# EAGLE design main_board (EAGLE 7.7.0)
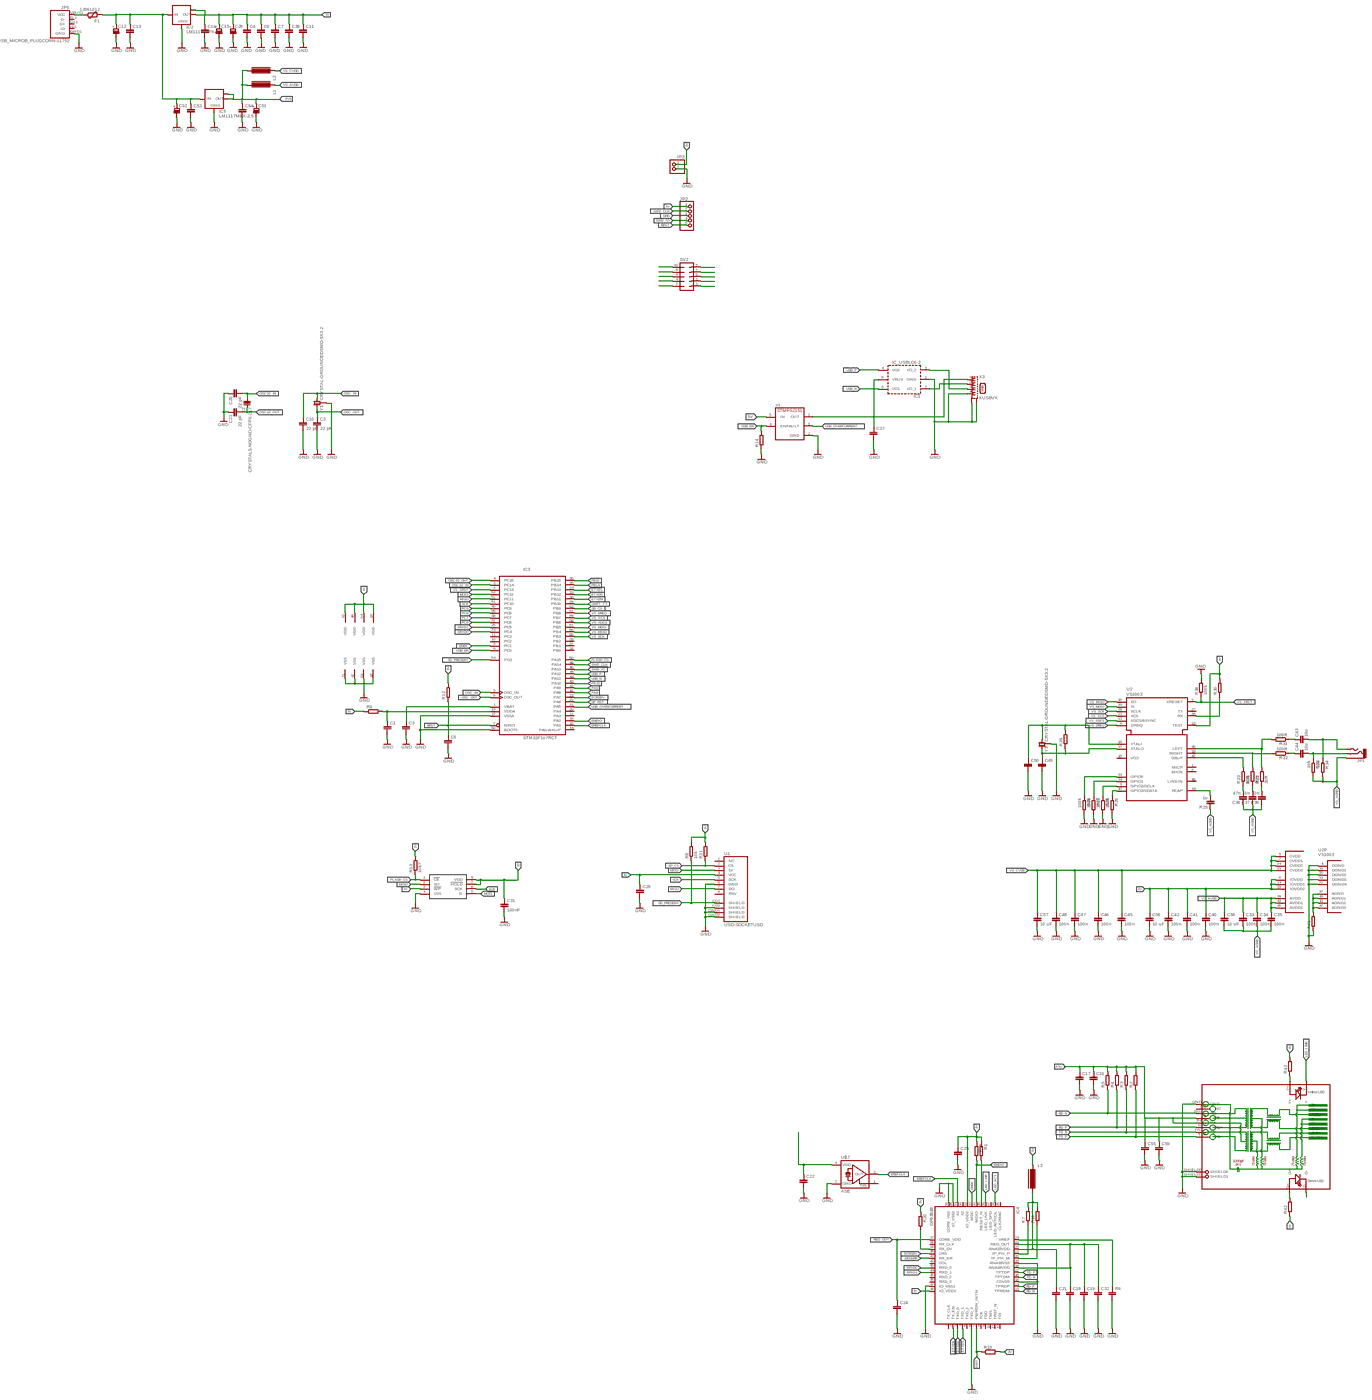
[diagram p0: schematic, sheet 1, overview]
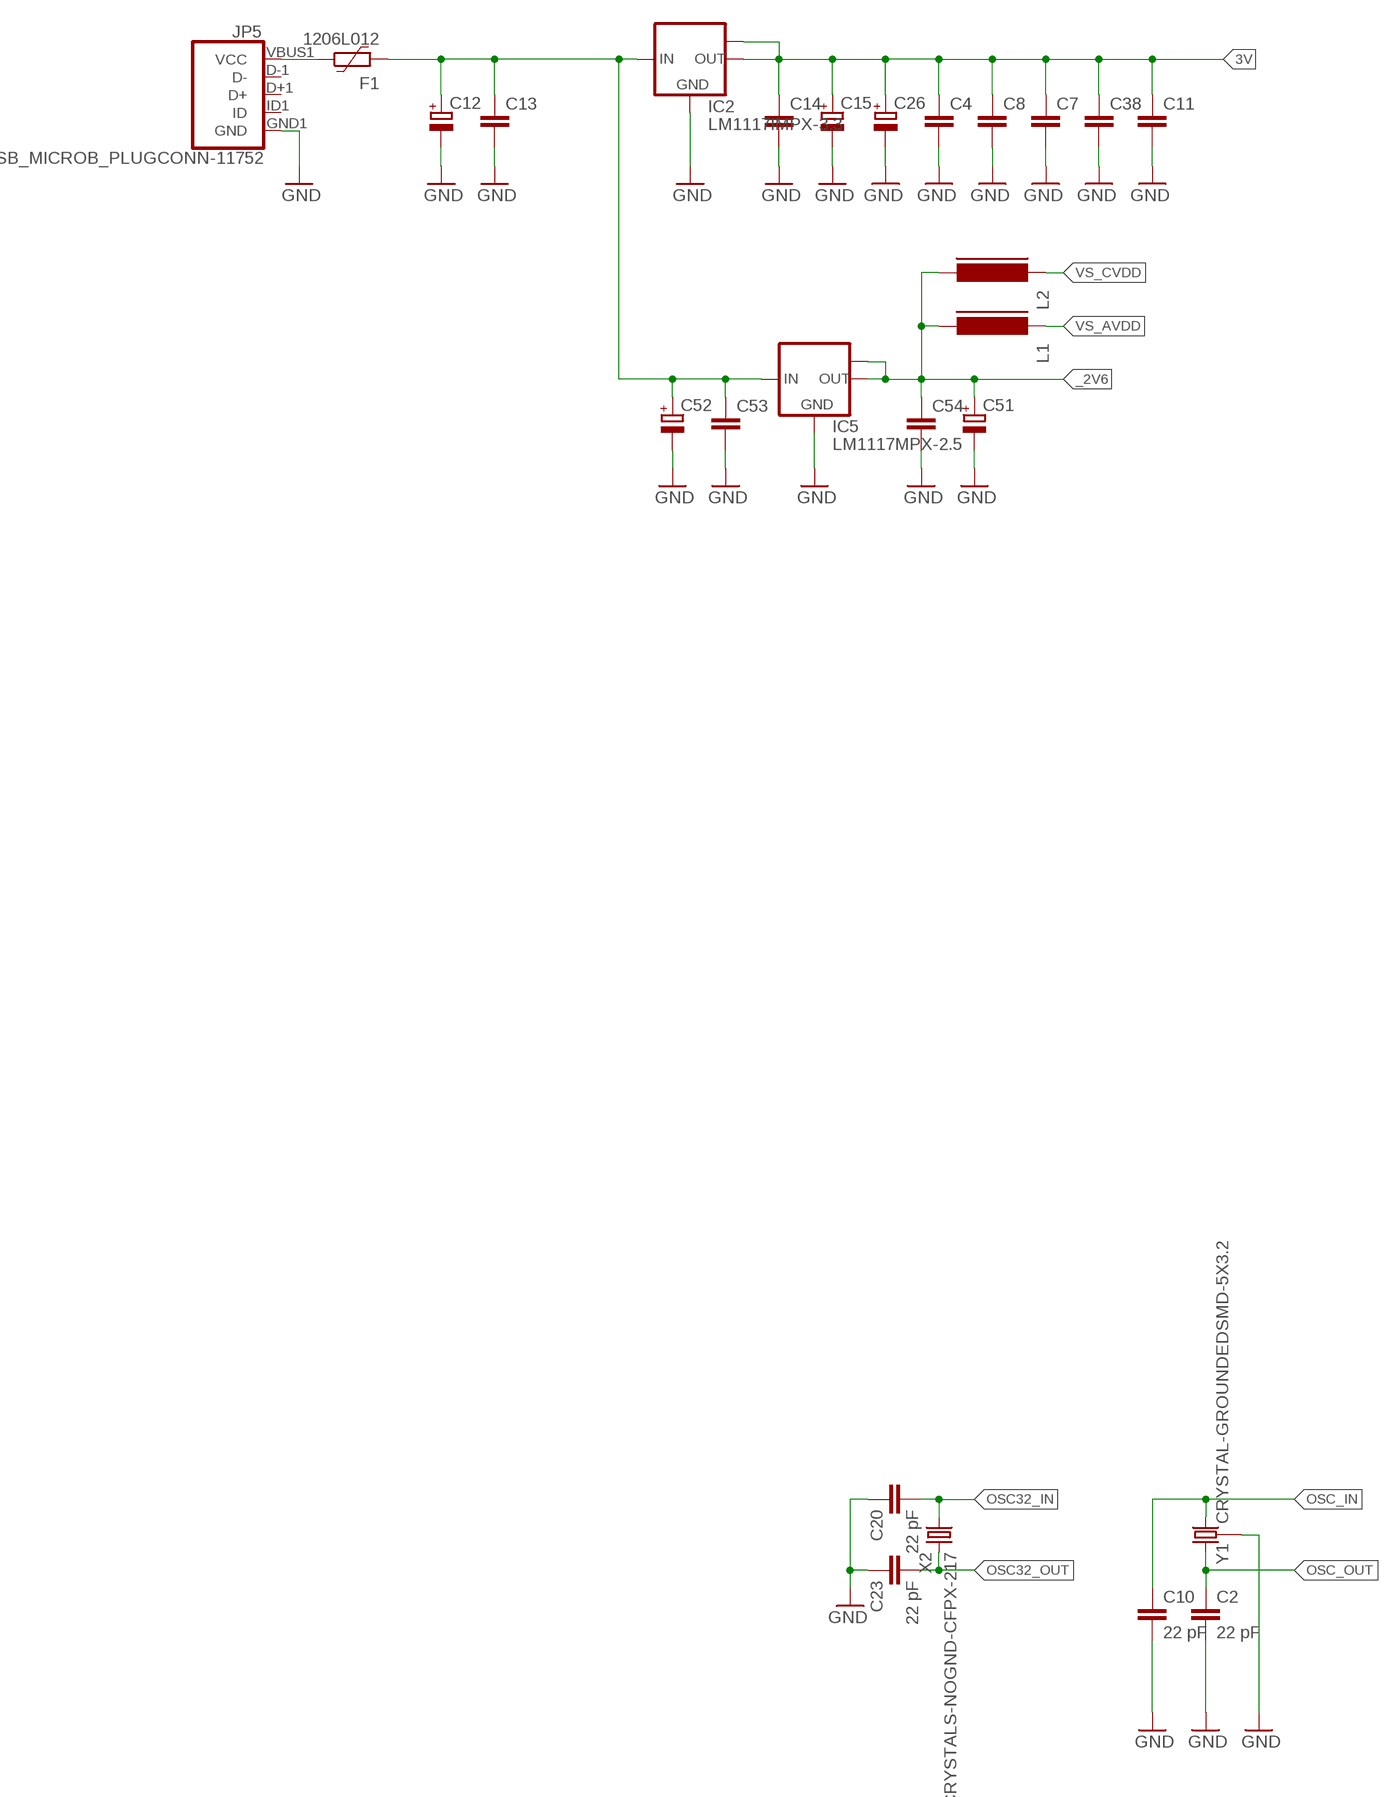
[diagram p1: schematic, sheet 1, part 1 of 4]
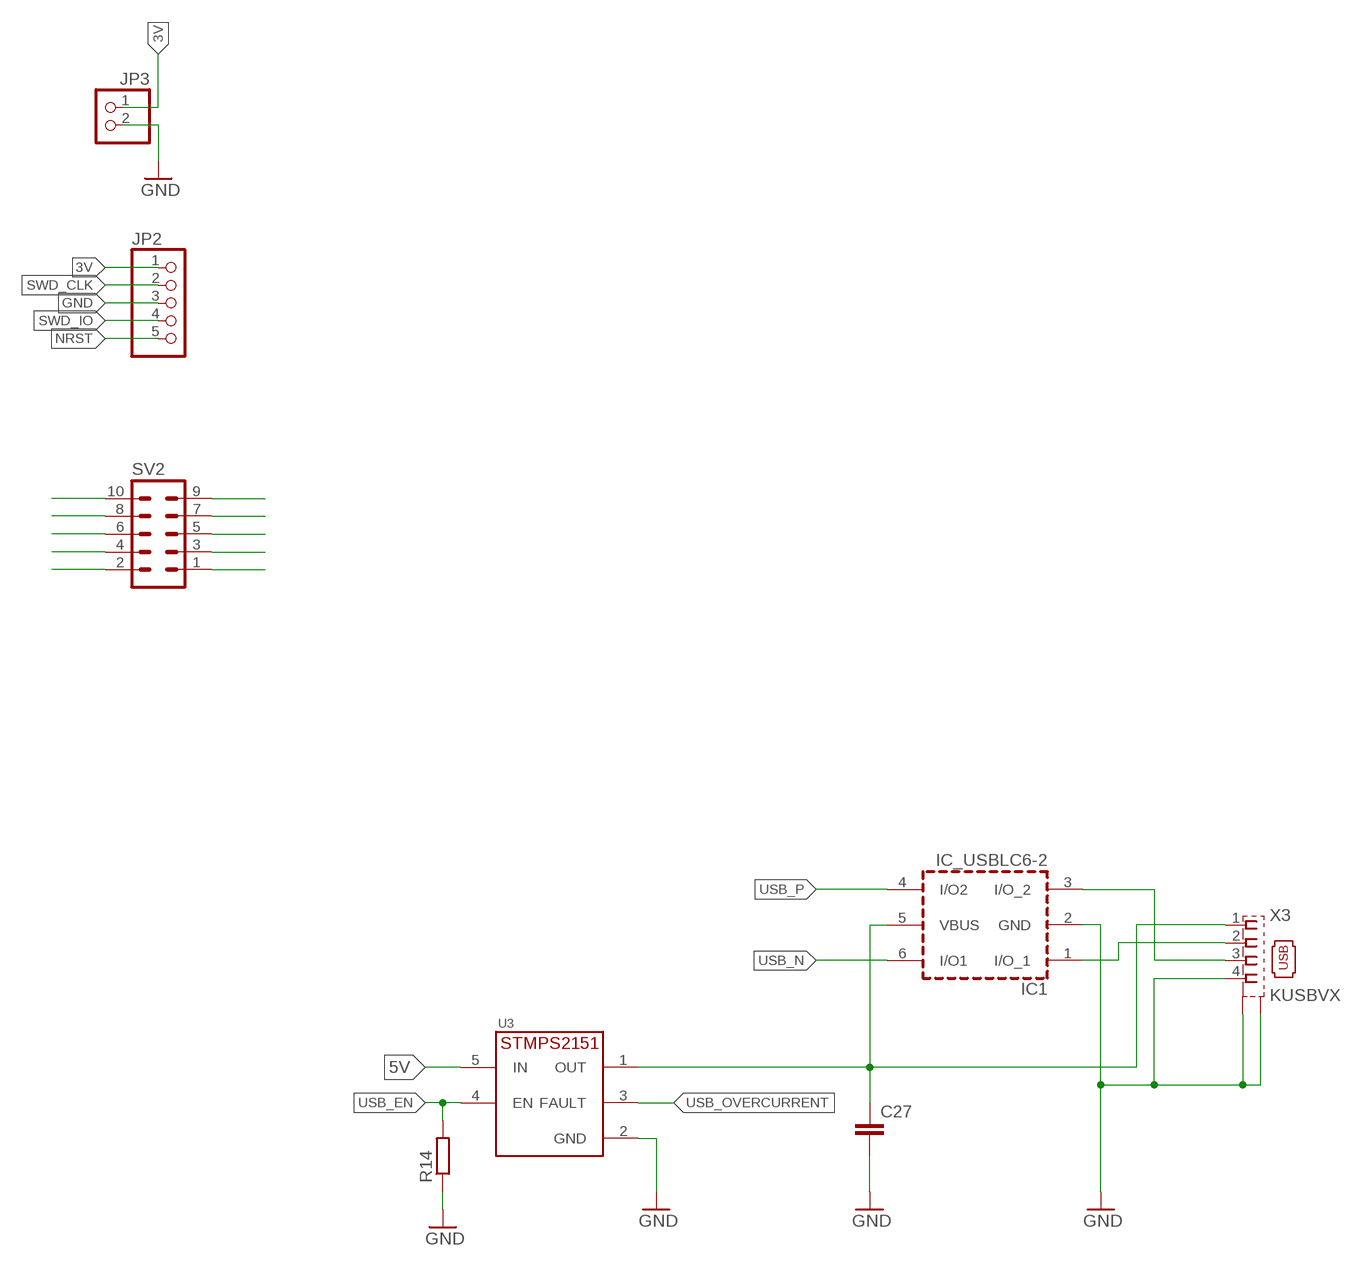
[diagram p2: schematic, sheet 1, part 2 of 4]
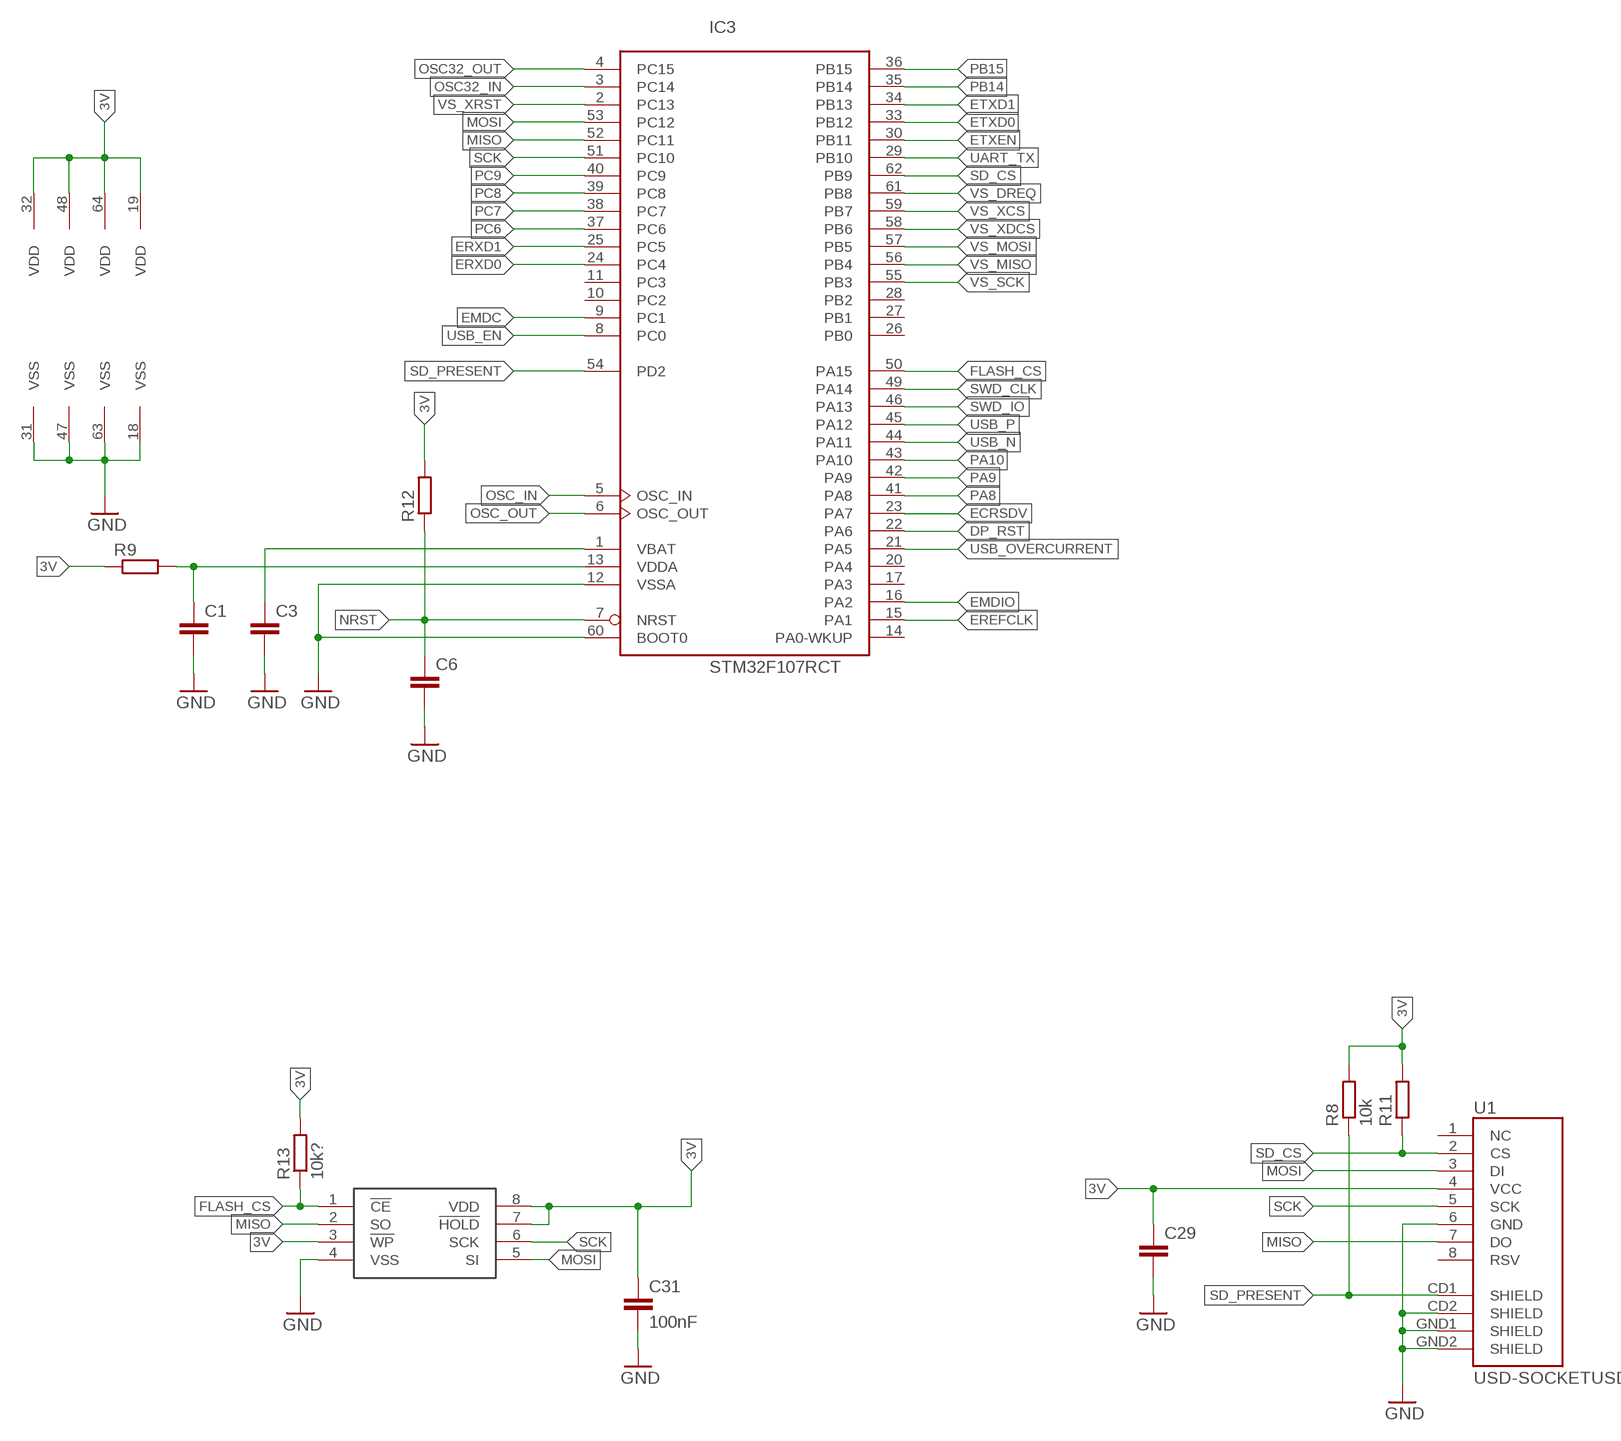
[diagram p3: schematic, sheet 1, part 3 of 4]
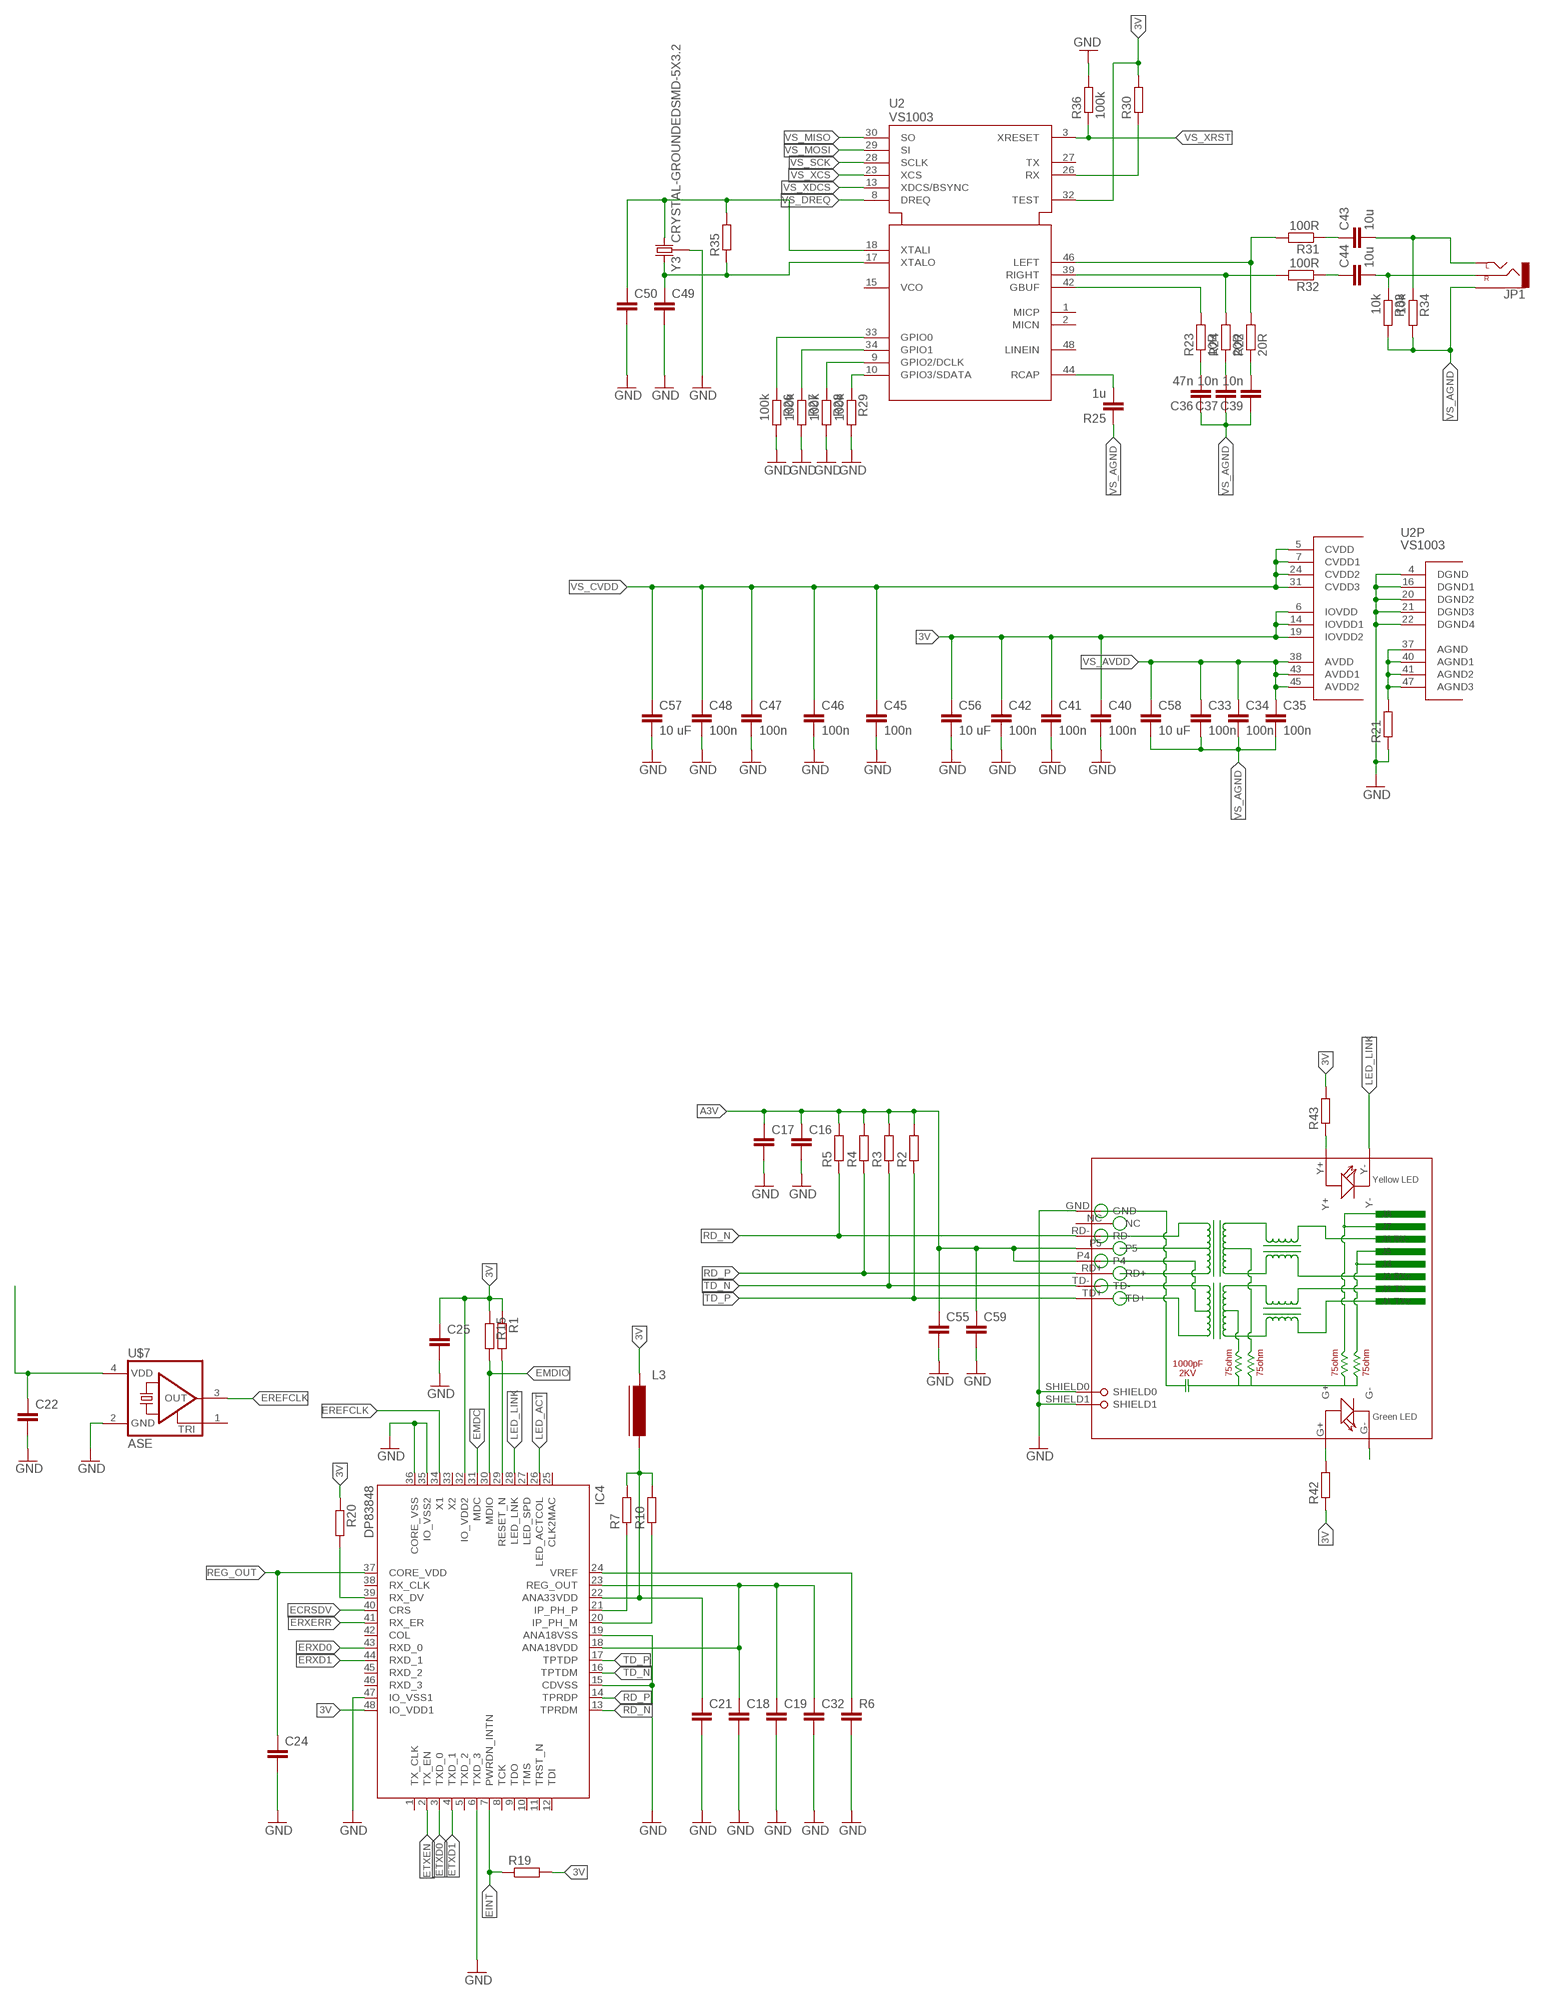
[diagram p4: schematic, sheet 1, part 4 of 4]

## Parts
C1  C-EUC0402  [C0402]
C2  22 pF  C-EUC0603  [C0603]
C3  C-EUC0402  [C0402]
C4  C-EUC0402  [C0402]
C6  C-EUC0603  [C0603]
C7  C-EUC0402  [C0402]
C8  C-EUC0402  [C0402]
C10  22 pF  C-EUC0603  [C0603]
C11  C-EUC0402  [C0402]
C12  CPOL-EUSMCB  [SMC_B]
C13  C-EUC0603  [C0603]
C14  C-EUC0603  [C0603]
C15  CPOL-EUSMCB  [SMC_B]
C16  C-EUC0603  [C0603]
C17  C-EUC0603  [C0603]
C18  C-EUC0402  [C0402]
C19  C-EUC0402  [C0402]
C20  22 pF  C-EUC0603  [C0603]
C21  C-EUC0402  [C0402]
C22  C-EUC0402  [C0402]
C23  22 pF  C-EUC0603  [C0603]
C24  C-EUC0603  [C0603]
C25  C-EUC0603  [C0603]
C26  CPOL-EUSMCA  [SMC_A]
C27  C-EUC0603  [C0603]
C29  C-EUC0603  [C0603]
C31  100nF  C-EUC0603  [C0603]
C32  C-EUC0603  [C0603]
C33  100n  C-EUC0603  [C0603]
C34  100n  C-EUC0603  [C0603]
C35  100n  C-EUC0603  [C0603]
C36  47n  C-EUC0603  [C0603]
C37  10n  C-EUC0603  [C0603]
C38  C-EUC0402  [C0402]
C39  10n  C-EUC0603  [C0603]
C40  100n  C-EUC0402  [C0402]
C41  100n  C-EUC0402  [C0402]
C42  100n  C-EUC0402  [C0402]
C43  10u  C-EUC0603  [C0603]
C44  10u  C-EUC0603  [C0603]
C45  100n  C-EUC0402  [C0402]
C46  100n  C-EUC0603  [C0603]
C47  100n  C-EUC0603  [C0603]
C48  100n  C-EUC0603  [C0603]
C49  C-EUC0603  [C0603]
C50  C-EUC0603  [C0603]
C51  CPOL-EUSMCB  [SMC_B]
C52  CPOL-EUSMCB  [SMC_B]
C53  C-EUC1206  [C1206]
C54  C-EUC1206  [C1206]
C55  C-EUC0603  [C0603]
C56  10 uF  C-EUC0603  [C0603]
C57  10 uF  C-EUC0603  [C0603]
C58  10 uF  C-EUC0603  [C0603]
C59  C-EUC0603  [C0603]
F1  1206L012  [1206L]
IC1  IC_USBLC6-2  [SOT-23-6L]
IC2  LM1117IMPX-3.3  [SOT223]
IC3  STM32F107RCT  [LQFP64]
IC4  DP83848  [LQFP48]
IC5  LM1117MPX-2.5  [SOT223]
JP1  AUDIO-JACKAUDIO_JACK2  [AUDIO-JACK2]
JP2  PINHD-1X5  [1X05]
JP3  PINHD-1X2/90  [1X02/90]
JP5  USB_MICROB_PLUGCONN-11752  [USB-B-MICRO-SMD_V03]
L1  FERRITE-0805  [FB805]
L2  FERRITE-0805  [FB805]
L3  FERRITE-0805  [FB805]
R1  R-EU_R0402  [R0402]
R2  R-EU_R0603  [R0603]
R3  R-EU_R0603  [R0603]
R4  R-EU_R0603  [R0603]
R5  R-EU_R0603  [R0603]
R6  C-EUC0603  [C0603]
R7  R-EU_R0402  [R0402]
R8  10k  R-EU_R0603  [R0603]
R9  R-EU_M0805  [M0805]
R10  R-EU_R0402  [R0402]
R11  R-EU_R0603  [R0603]
R12  R-EU_R0603  [R0603]
R13  10k?  R-EU_R0603  [R0603]
R14  R-EU_R0603  [R0603]
R15  R-EU_R0603  [R0603]
R19  R-EU_R0402  [R0402]
R20  R-EU_R0603  [R0603]
R21  R-EU_R0603  [R0603]
R22  20R  R-EU_R0603  [R0603]
R23  10R  R-EU_R0603  [R0603]
R24  20R  R-EU_R0603  [R0603]
R25  1u  C-EUC0603  [C0603]
R26  100k  R-EU_R0402  [R0402]
R27  100k  R-EU_R0402  [R0402]
R28  100k  R-EU_R0402  [R0402]
R29  100k  R-EU_R0402  [R0402]
R30  R-EU_0204/7  [0204/7]
R31  100R  R-EU_R0603  [R0603]
R32  100R  R-EU_R0603  [R0603]
R33  10k  R-EU_R0603  [R0603]
R34  10k  R-EU_R0603  [R0603]
R35  R-EU_R0603  [R0603]
R36  100k  R-EU_R0603  [R0603]
R42  R-EU_R0603  [R0603]
R43  R-EU_R0603  [R0603]
RJ1  HR911105A  [HR911105A]
SV2  ML10L  [ML10L]
U1  USD-SOCKETUSD  [USD-SOCKET-PP]
U2  VS1003  [LQFP48]
U3  STMPS2151STR  [SOT-23-5L]
U$2  SST25VF016BSO8M  [SO-08M]
U$7  ASE  [ASE]
X2  CRYSTALS-NOGND-CFPX-217  [3.2X1.5-2-PAD]
X3  KUSBVX  [KUSBVX]
Y1  CRYSTAL-GROUNDEDSMD-5X3.2  [CRYSTAL-SMD-5X3.2-4PAD]
Y3  CRYSTAL-GROUNDEDSMD-5X3.2  [CRYSTAL-SMD-5X3.2-4PAD]

## Nets
3V: C4.1 C7.1 C8.1 C11.1 C14.1 C15.+ C22.1 C25.1 C26.+ C29.1 C31.1 C38.1 C40.1 C41.1 C42.1 C56.1 IC2.2(OUT) IC2.TAB(OUT1) IC3.19(VDD) IC3.32(VDD) IC3.48(VDD) IC3.64(VDD) IC4.32(IO_VDD2) IC4.48(IO_VDD1) JP2.1 JP3.1 L3.1 R1.1 R8.2 R9.1 R11.2 R12.2 R13.2 R15.1 R19.2 R20.1 R30.2 R42.1 R43.2 U1.4(VCC) U2.6(IOVDD) U2.14(IOVDD1) U2.19(IOVDD2) U2.32(TEST) U$2.3(!WP) U$2.7(!HOLD) U$2.8(VDD) U$7.4(VDD)
5V: C12.+ C13.1 C52.+ C53.1 F1.2 IC2.3(IN) IC5.3(IN) U3.5(IN)
_2V6: C51.+ C54.1 IC5.2(OUT) IC5.TAB(OUT1) L1.2 L2.2
A3V: C16.1 C17.1 C21.1 C55.1 C59.1 IC4.22(ANA33VDD) L3.2 R2.2 R3.2 R4.2 R5.2 R7.2 R10.2 RJ1.P4 RJ1.P5
D2_N: IC1.1(I/O_1) X3.2
D2_P: IC1.3(I/O_2) X3.3
DP_RST: IC3.22(PA6) IC4.29(RESET_N) R1.2
ECRSDV: IC3.23(PA7) IC4.40(CRS)
EINT: IC4.7(PWRDN_INTN) R19.1
EMDC: IC3.9(PC1) IC4.31(MDC)
EMDIO: IC3.16(PA2) IC4.30(MDIO) R15.2
EREFCLK: IC3.15(PA1) IC4.34(X1) U$7.3(OUT)
ERXD0: IC3.24(PC4) IC4.43(RXD_0)
ERXD1: IC3.25(PC5) IC4.44(RXD_1)
ERXERR: IC4.41(RX_ER)
ETXD0: IC3.33(PB12) IC4.3(TXD_0)
ETXD1: IC3.34(PB13) IC4.4(TXD_1)
ETXEN: IC3.30(PB11) IC4.2(TX_EN)
FLASH_CS: IC3.50(PA15) R13.1 U$2.1(!CE)
GND: C1.2 C2.2 C3.2 C4.2 C6.2 C7.2 C8.2 C10.2 C11.2 C12.- C13.2 C14.2 C15.- C16.2 C17.2 C18.2 C19.2 C20.1 C21.2 C22.2 C23.1 C24.2 C25.2 C26.- C27.2 C29.2 C31.2 C32.2 C38.2 C40.2 C41.2 C42.2 C45.2 C46.2 C47.2 C48.2 C49.2 C50.2 C51.- C52.- C53.2 C54.2 C55.2 C56.2 C57.2 C59.2 IC1.2(GND) IC2.1(GND) IC3.12(VSSA) IC3.18(VSS) IC3.31(VSS) IC3.47(VSS) IC3.60(BOOT0) IC3.63(VSS) IC4.6(TXD_3) IC4.15(CDVSS) IC4.19(ANA18VSS) IC4.35(IO_VSS2) IC4.36(CORE_VSS) IC4.47(IO_VSS1) IC5.1(GND) JP2.3 JP3.2 JP5.GND1(GND) R6.2 R14.1 R21.1 R26.2 R27.2 R28.2 R29.2 R36.2 RJ1.GND RJ1.SHIELD0 RJ1.SHIELD1 U1.6(GND) U1.CD2(SHIELD) U1.GND1(SHIELD) U1.GND2(SHIELD) U2.4(DGND) U2.16(DGND1) U2.20(DGND2) U2.21(DGND3) U2.22(DGND4) U3.2(GND) U$2.4(VSS) U$7.2(GND) X3.4 X3.M1(S1) X3.M2(S2) Y1.2 Y1.4 Y3.2 Y3.4
LED_ACT: IC4.26(LED_ACTCOL) RJ1.G-
LED_LINK: IC4.28(LED_LNK) RJ1.Y-
MISO: IC3.52(PC11) U1.7(DO) U$2.2(SO)
MOSI: IC3.53(PC12) U1.3(DI) U$2.5(SI)
N$1: IC4.21(IP_PH_P) R7.1
N$2: C3.1 IC3.1(VBAT)
N$3: IC4.24(VREF) R6.1
N$6: IC4.20(IP_PH_M) R10.1
N$12: R42.2 RJ1.G+
N$17: F1.1 JP5.VBUS1(VCC)
N$18: C36.2 R23.1
N$19: R43.1 RJ1.Y+
N$28: C1.1 IC3.13(VDDA) R9.2
NRST: C6.1 IC3.7(NRST) JP2.5 R12.1
OSC32_IN: C20.2 IC3.3(PC14) X2.1
OSC32_OUT: C23.2 IC3.4(PC15) X2.2
OSC_IN: C10.1 IC3.5(OSC_IN) Y1.1
OSC_OUT: C2.1 IC3.6(OSC_OUT) Y1.3
PA8: IC3.41(PA8) SV2.8
PA9: IC3.42(PA9) SV2.9
PA10: IC3.43(PA10) SV2.10
PB14: IC3.35(PB14) SV2.2
PB15: IC3.36(PB15) SV2.3
PC6: IC3.37(PC6) SV2.4
PC7: IC3.38(PC7) SV2.5
PC8: IC3.39(PC8) SV2.6
PC9: IC3.40(PC9) SV2.7
RD_N: IC4.13(TPRDM) R5.1 RJ1.RD-
RD_P: IC4.14(TPRDP) R4.1 RJ1.RD+
REG_OUT: C18.1 C19.1 C24.1 C32.1 IC4.18(ANA18VDD) IC4.23(REG_OUT) IC4.37(CORE_VDD)
RX_DV: IC4.39(RX_DV) R20.2
SCK: IC3.51(PC10) U1.5(SCK) U$2.6(SCK)
SD_CS: IC3.62(PB9) R11.1 U1.2(CS)
SD_PRESENT: IC3.54(PD2) R8.1 U1.CD1(SHIELD)
SWD_CLK: IC3.49(PA14) JP2.2
SWD_IO: IC3.46(PA13) JP2.4
TD_N: IC4.16(TPTDM) R3.1 RJ1.TD-
TD_P: IC4.17(TPTDP) R2.1 RJ1.TD+
UART_TX: IC3.29(PB10) SV2.1
USB_EN: IC3.8(PC0) R14.2 U3.4(EN)
USB_N: IC1.6(I/O1) IC3.44(PA11)
USB_OVERCURRENT: IC3.21(PA5) U3.3(FAULT)
USB_P: IC1.4(I/O2) IC3.45(PA12)
VBUS: C27.1 IC1.5(VBUS) U3.1(OUT) X3.1
VS_AGND: C33.2 C34.2 C35.2 C36.1 C37.1 C39.1 C58.2 JP1.SLEEVE R21.2 R25.1 R33.2 R34.2 U2.37(AGND) U2.40(AGND1) U2.41(AGND2) U2.47(AGND3)
VS_AVDD: C33.1 C34.1 C35.1 C58.1 L1.1 U2.38(AVDD) U2.43(AVDD1) U2.45(AVDD2)
VS_CVDD: C45.1 C46.1 C47.1 C48.1 C57.1 L2.1 U2.5(CVDD) U2.7(CVDD1) U2.24(CVDD2) U2.31(CVDD3)
VS_DREQ: IC3.61(PB8) U2.8(DREQ)
VS_MISO: IC3.56(PB4) U2.30(SO)
VS_MOSI: IC3.57(PB5) U2.29(SI)
VS_N$9: C50.1 R35.2 U2.18(XTALI) Y3.1
VS_N$13: C49.1 R35.1 U2.17(XTALO) Y3.3
VS_N$14: R22.2 R31.2 U2.46(LEFT)
VS_N$15: R23.2 U2.42(GBUF)
VS_N$16: R24.2 R32.2 U2.39(RIGHT)
VS_N$17: R25.2 U2.44(RCAP)
VS_N$24: C37.2 R24.1
VS_N$25: C39.2 R22.1
VS_N$26: R29.1 U2.10(GPIO3/SDATA)
VS_N$27: R28.1 U2.9(GPIO2/DCLK)
VS_N$28: R27.1 U2.34(GPIO1)
VS_N$30: R26.1 U2.33(GPIO0)
VS_N$34: R30.1 U2.26(RX)
VS_N$35: C43.1 R31.1
VS_N$36: C44.1 R32.1
VS_N$37: C44.2 JP1.RING(RIGHT) R33.1
VS_N$38: C43.2 JP1.TIP(LEFT) R34.1
VS_SCK: IC3.55(PB3) U2.28(SCLK)
VS_XCS: IC3.59(PB7) U2.23(XCS)
VS_XDCS: IC3.58(PB6) U2.13(XDCS/BSYNC)
VS_XRST: IC3.2(PC13) R36.1 U2.3(XRESET)
Unconnected: IC3.10(PC2) IC3.11(PC3) IC3.14(PA0-WKUP) IC3.17(PA3) IC3.20(PA4) IC3.26(PB0) IC3.27(PB1) IC3.28(PB2) IC4.1(TX_CLK) IC4.5(TXD_2) IC4.8(TCK) IC4.9(TDO) IC4.10(TMS) IC4.11(TRST_N) IC4.12(TDI) IC4.25(CLK2MAC) IC4.27(LED_SPD) IC4.33(X2) IC4.38(RX_CLK) IC4.42(COL) IC4.45(RXD_2) IC4.46(RXD_3) JP5.D+1(D+) JP5.D-1(D-) JP5.ID1(ID) RJ1.NC U1.1(NC) U1.8(RSV) U2.1(MICP) U2.2(MICN) U2.15(VCO) U2.27(TX) U2.48(LINEIN) U$7.1(TRI)

## Library data of the parts
C1-C4 C6-C8 C10 C11 C13 C14 C16-C25 C27 C29 C31-C50 C53-C59 R6 R25 = rcl:C-EU: CAPACITOR, European symbol
C12 C15 C26 C51 C52 = rcl:CPOL-EU: POLARIZED CAPACITOR, European symbol
F1 = polyfuse-smd_10:?: Polyfuse Resettable PTC Source: http://www.littelfuse.com/products/resettable-ptcs.aspx; MF: Littelfuse; MPN: 1206L012; OC_FARNELL: 1596988; OC_NEWARK: 05M2298
IC1 = dp_devices:IC_USBLC6-2
IC2 = lm1117:LM1117IMPX-*
IC3 = micro-stm_v2:STM32F107R*T: ARM 32-bit Cortex™-M3 CPU 72 MHz maximum frequency 128 to 256 Kbytes of Flash memory 64 kbytes of SRAM 51 GPIOs 2.0 to 3.6 V application supply
IC4 = national-semiconductor:DP83848: PHYTER® - Extended Temperature Single Port 10/100 Mb/s Ethernet Physical Layer Transceiver Auto generated by make-symbol-device-package-bsdl.ulp Rev. 34 Source: dp83848yb.bsdl http://www.national.com/ds/DP/DP83848VYB.pdf; MPN: DP83848VYB; OC_FARNELL: 1286817; OC_NEWARK: 11N4484
IC5 = lm1117:LM1117MPX-*
JP1 = SparkFun-Connectors:AUDIO-JACK: 3.5mm Audio Jack Simple 3.5mm common PCB mount audio jack. SKU: PRT-08032
JP2 = pinhead:PINHD-1X5: PIN HEADER
JP3 = pinhead:PINHD-1X2: PIN HEADER
JP5 = SparkFun-Connectors:USB_MICROB_PLUG: USB Micro-B connectors Some male, some female. Watch your step!; PROD_ID: CONN-11752
L1-L3 = dp_devices:FERRITE: Ferrite bead in various packages
R1-R5 R7-R15 R19-R24 R26-R36 R42 R43 = rcl:R-EU_: RESISTOR, European symbol
RJ1 = hanrun:HR911105A
SV2 = con-harting-ml:ML10: HARTING; OC_FARNELL: unknown; OC_NEWARK: unknown
U1 = SparkFun-Connectors:USD-SOCKET: microSD Socket Push-push type uSD socket. Schematic element and footprint production proven. Spark Fun Electronics SKU : PRT-00127. tDoc lines correctly indicate media card edge positions when inserting (unlocked, locked, depressed).
U2 = vlsi-web:VS1003: MP3 / WMA / MIDI Audio Codec Circuit
U3 = FaBo-Supply:STMPS2151STR
U$2 = mw:SST25VF016B
U$7 = crystal:ASE: 3.3Vdc CMOS SMD CRYSTAL CLOCK OSCILLATOR SOurce: www.abracon.com; OC_FARNELL: unknown; OC_NEWARK: unknown
X2 = IQD-Frequency-Products:CRYSTALS-NOGND: CRYSTALS CAN NOT GROUNDED
X3 = con-kycon:KUSBVX: Vertical,Top Entry Universal Serial Bus Connector KUSBVX Series Source: KYCON Sibalco USB vertical socket KUSBV.pdf
Y1 Y3 = SparkFun-Clocks:CRYSTAL-GROUNDED: Crystals w/ Ground Pin (Generic) These are passive quartz crystals, which can be used as a clock source for a microcontroller. Crystal's are usually two-terminal devices. A third terminal may be optionally connected to ground, as recommended by the manufaturer.

## Board
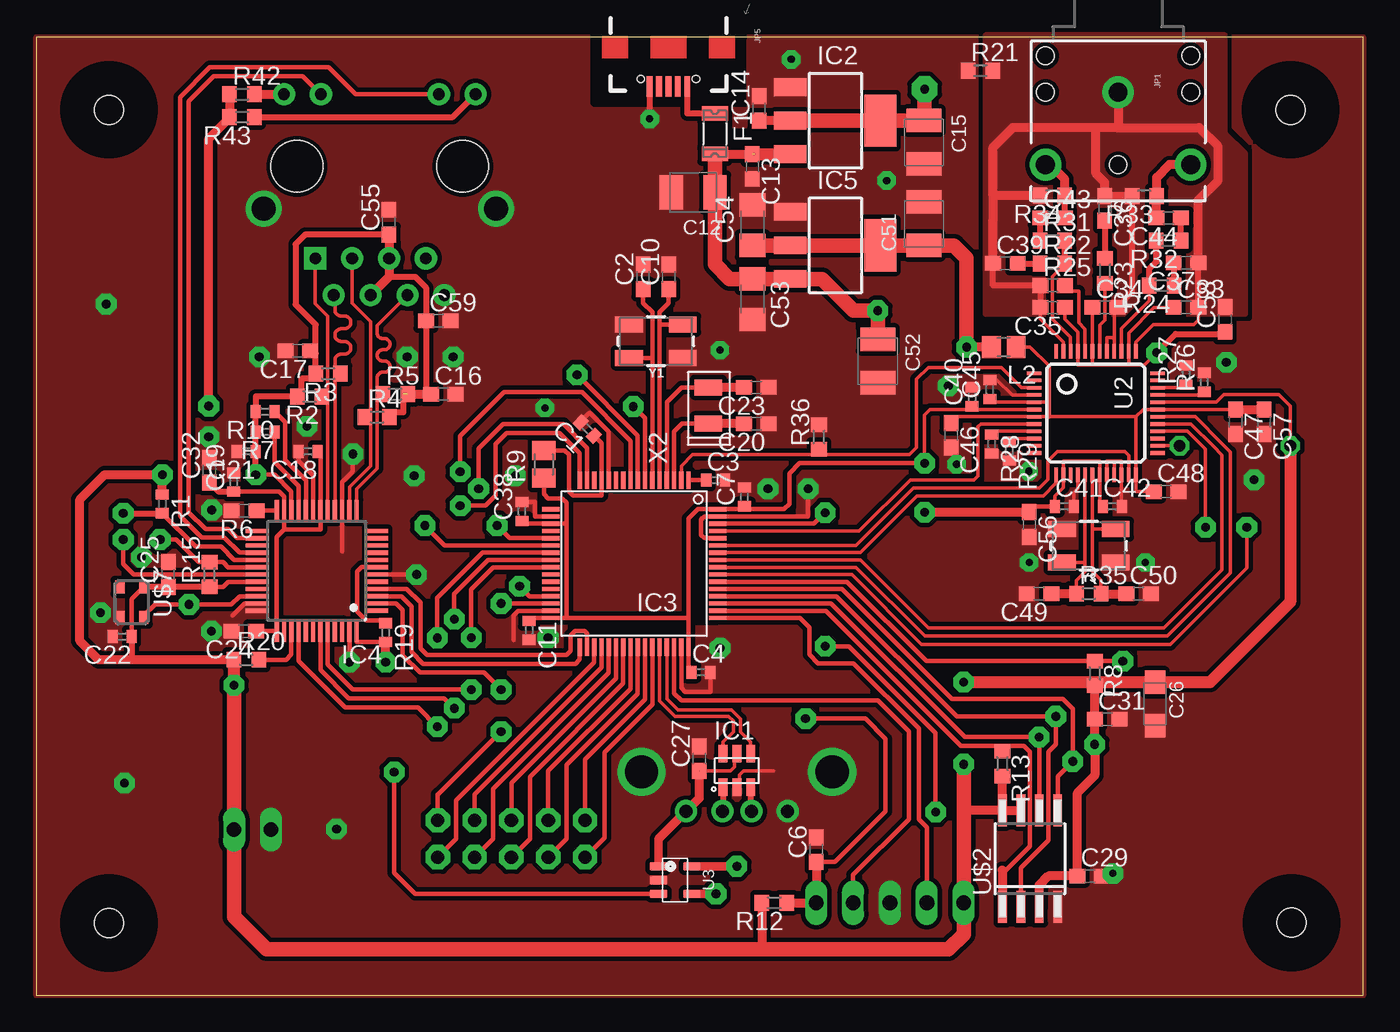
[diagram p5: board, top side]
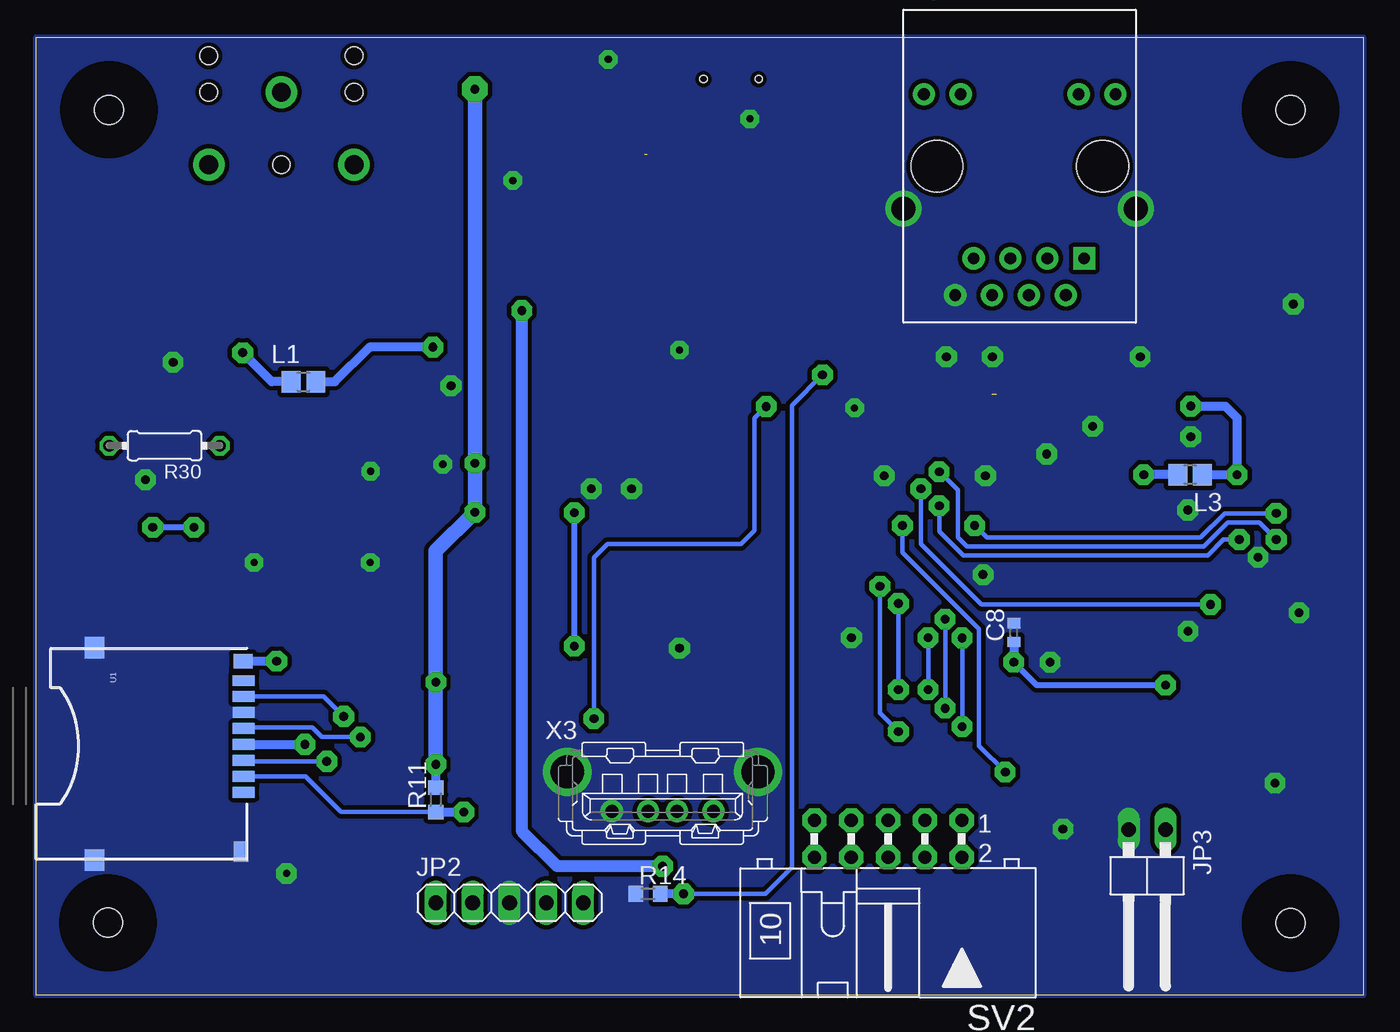
[diagram p6: board, bottom side, seen from below]

Size 91.44 x 66.04 mm. Coordinates in mm from the lower left corner, seen from the top.
Outline: 0,0 91.44,0 91.44,66.04 0,66.04 0,0
Copper layers (1*16): Top 0.035mm / dielectric 1.5mm / Bottom 0.035mm
Design rules "default *": minimum track width 10mil, minimum drill 24mil, track to track 8mil, track to pad 8mil, pad to pad 8mil, via to via 8mil, smd to smd 8mil, copper to edge 0mil, drill to drill 8mil, minimum pad ring 10mil, minimum via ring 8mil, stop-mask expansion 4mil, vias tented up to drill 0mil, thermal gap 10mil
Holes 2 mm at 5,5 86.49,5.01 86.44,61.04 5,61.04
tRestrict: area 47,14.6 to 49.5,16.5; area 45.9,58.4 to 47.7,60.2; area 38.5,61.5 to 48.6,66; area 2,2 to 8,8; area 83.4,2 to 89.5,8.1; area 83.4,58 to 89.5,64.1; area 2,58 to 8,64.1; area 70.1,43.9 to 75.9,44.9; area 68.2,37.2 to 69.3,43; area 76.8,37.2 to 77.8,43; area 70.1,35.4 to 75.9,37.3; area 47.9,58.8 to 53.1,59.4; 3 more areas
bRestrict: area 2,2 to 8,8; area 83.4,2 to 89.5,8.1; area 83.4,58 to 89.5,64.1; area 2,58 to 8,64.1

### Footprints (pad centres in the part's own frame; a part is rotated, then mirrored left to right if it is on the bottom)
C0402 = smd 0.7 x 0.9: 1 -0.65,0; 2 0.65,0
C0603 = smd 1.1 x 1: 1 -0.85,0; 2 0.85,0
SMC_B = smd 1.6 x 2.4: + -1.5,0; - 1.5,0
SMC_A = smd 1.6 x 1.4: + -1.5,0; - 1.5,0
C1206 = smd 1.6 x 1.8: 1 -1.4,0; 2 1.4,0
1206L = smd 1 x 1.8: 1 -1.4,0; 2 1.4,0
SOT-23-6L = smd 0.6 x 1.2: 1 -0.95,-2.3; 2 0,-2.3; 3 0.95,-2.3; 4 0.95,0; 5 0,0; 6 -0.95,0
SOT223 = smd 1.219 x 2.235: 1 -2.311,-3.099; 2 0,-3.099; 3 2.311,-3.099 | smd 3.6 x 2.2: TAB 0,3.099
LQFP64 = smd 0.3 x 1.2: 1 -3.75,-5.75; 2 -3.25,-5.75; 3 -2.75,-5.75; 4 -2.25,-5.75; 5 -1.75,-5.75; 6 -1.25,-5.75; 7 -0.75,-5.75; 8 -0.25,-5.75; 9 0.25,-5.75; 10 0.75,-5.75; 11 1.25,-5.75; 12 1.75,-5.75; 13 2.25,-5.75; 14 2.75,-5.75; 15 3.25,-5.75; 16 3.75,-5.75; 33 3.75,5.75; 34 3.25,5.75; 35 2.75,5.75; 36 2.25,5.75; 37 1.75,5.75; 38 1.25,5.75; 39 0.75,5.75; 40 0.25,5.75; 41 -0.25,5.75; 42 -0.75,5.75; 43 -1.25,5.75; 44 -1.75,5.75; 45 -2.25,5.75; 46 -2.75,5.75; 47 -3.25,5.75; 48 -3.75,5.75 | smd 1.2 x 0.3: 17 5.75,-3.75; 18 5.75,-3.25; 19 5.75,-2.75; 20 5.75,-2.25; 21 5.75,-1.75; 22 5.75,-1.25; 23 5.75,-0.75; 24 5.75,-0.25; 25 5.75,0.25; 26 5.75,0.75; 27 5.75,1.25; 28 5.75,1.75; 29 5.75,2.25; 30 5.75,2.75; 31 5.75,3.25; 32 5.75,3.75; 49 -5.75,3.75; 50 -5.75,3.25; 51 -5.75,2.75; 52 -5.75,2.25; 53 -5.75,1.75; 54 -5.75,1.25; 55 -5.75,0.75; 56 -5.75,0.25; 57 -5.75,-0.25; 58 -5.75,-0.75; 59 -5.75,-1.25; 60 -5.75,-1.75; 61 -5.75,-2.25; 62 -5.75,-2.75; 63 -5.75,-3.25; 64 -5.75,-3.75
LQFP48 = smd 1.5 x 0.3: 1 -4.15,2.75; 2 -4.15,2.25; 3 -4.15,1.75; 4 -4.15,1.25; 5 -4.15,0.75; 6 -4.15,0.25; 7 -4.15,-0.25; 8 -4.15,-0.75; 9 -4.15,-1.25; 10 -4.15,-1.75; 11 -4.15,-2.25; 12 -4.15,-2.75; 25 4.15,-2.75; 26 4.15,-2.25; 27 4.15,-1.75; 28 4.15,-1.25; 29 4.15,-0.75; 30 4.15,-0.25; 31 4.15,0.25; 32 4.15,0.75; 33 4.15,1.25; 34 4.15,1.75; 35 4.15,2.25; 36 4.15,2.75 | smd 0.3 x 1.5: 13 -2.75,-4.15; 14 -2.25,-4.15; 15 -1.75,-4.15; 16 -1.25,-4.15; 17 -0.75,-4.15; 18 -0.25,-4.15; 19 0.25,-4.15; 20 0.75,-4.15; 21 1.25,-4.15; 22 1.75,-4.15; 23 2.25,-4.15; 24 2.75,-4.15; 37 2.75,4.15; 38 2.25,4.15; 39 1.75,4.15; 40 1.25,4.15; 41 0.75,4.15; 42 0.25,4.15; 43 -0.25,4.15; 44 -0.75,4.15; 45 -1.25,4.15; 46 -1.75,4.15; 47 -2.25,4.15; 48 -2.75,4.15
AUDIO-JACK2 = drill 1.3 pad 2.184: RING 5,5; SLEEVE 0,0; TIP 5,-5 | hole 1.2: 0,5; -2.5,5; -2.5,-5; 0,-5; 5,0
1X05 = drill 1.016 long: 1 -5.08,0; 2 -2.54,0; 3 0,0; 4 2.54,0; 5 5.08,0
1X02/90 = drill 1.016 long: 1 -1.27,-3.81; 2 1.27,-3.81
USB-B-MICRO-SMD_V03 = smd 1.4 x 0.4: D+1 2.7,0; D-1 2.7,0.65; GND1 2.7,-1.3; ID1 2.7,-0.65; VBUS1 2.7,1.3 | hole 0.5: 2.2,1.9; 2.2,-1.9
FB805 = smd 1.3 x 1.5: 1 -0.85,0; 2 0.85,0
R0402 = smd 0.7 x 0.9: 1 -0.65,0; 2 0.65,0
R0603 = smd 1 x 1.1: 1 -0.85,0; 2 0.85,0
M0805 = smd 1.3 x 1.6: 1 -0.95,0; 2 0.95,0
0204/7 = drill 0.813 octagon: 1 -3.81,0; 2 3.81,0
HR911105A = drill 0.813 pad 1.524: G+ 4.953,-6.604; G- 4.953,-4.064; GND -8.89,4.445; NC -6.35,3.175; P4 -8.89,-0.635; P5 -6.35,0.635; RD+ -6.35,-1.905; RD- -8.89,1.905; TD- -8.89,-3.175; Y+ 4.953,6.604; Y- 4.953,4.064 | drill 1.651 pad 2.159: SHIELD0 -2.921,8.001; SHIELD1 -2.921,-8.001 | drill 0.813 pad 1.524 square: TD+ -6.35,-4.445 | hole 3.556: 0,-5.715; 0,5.715
ML10L = drill 0.914 pad 1.676 octagon: 1 -5.08,-1.27; 2 -5.08,1.27; 3 -2.54,-1.27; 4 -2.54,1.27; 5 0,-1.27; 6 0,1.27; 7 2.54,-1.27; 8 2.54,1.27; 9 5.08,-1.27; 10 5.08,1.27
USD-SOCKET-PP = smd 0.75 x 1.5: 1 3.2,14.3; 2 2.1,14.3; 3 1,14.3; 4 -0.1,14.3; 5 -1.2,14.3; 6 -2.3,14.3; 7 -3.4,14.3; 8 -4.5,14.3 | smd 1 x 1.3: CD1 -5.85,14.25 | smd 1.4 x 1: CD2 7.275,14.1 | smd 1.5 x 1.35: GND1 -6.775,4; GND2 7.875,4
LQFP48' = smd 0.25 x 1: 1 -2.75,-4.25; 2 -2.25,-4.25; 3 -1.75,-4.25; 4 -1.25,-4.25; 5 -0.75,-4.25; 6 -0.25,-4.25; 7 0.25,-4.25; 8 0.75,-4.25; 9 1.25,-4.25; 10 1.75,-4.25; 11 2.25,-4.25; 12 2.75,-4.25; 25 2.75,4.25; 26 2.25,4.25; 27 1.75,4.25; 28 1.25,4.25; 29 0.75,4.25; 30 0.25,4.25; 31 -0.25,4.25; 32 -0.75,4.25; 33 -1.25,4.25; 34 -1.75,4.25; 35 -2.25,4.25; 36 -2.75,4.25 | smd 1 x 0.25: 13 4.25,-2.75; 14 4.25,-2.25; 15 4.25,-1.75; 16 4.25,-1.25; 17 4.25,-0.75; 18 4.25,-0.25; 19 4.25,0.25; 20 4.25,0.75; 21 4.25,1.25; 22 4.25,1.75; 23 4.25,2.25; 24 4.25,2.75; 37 -4.25,2.75; 38 -4.25,2.25; 39 -4.25,1.75; 40 -4.25,1.25; 41 -4.25,0.75; 42 -4.25,0.25; 43 -4.25,-0.25; 44 -4.25,-0.75; 45 -4.25,-1.25; 46 -4.25,-1.75; 47 -4.25,-2.25; 48 -4.25,-2.75
SOT-23-5L = smd 0.6 x 1.2: 1 -0.95,-1.15; 2 0,-1.15; 3 0.95,-1.15; 4 0.95,1.15; 5 -0.95,1.15
SO-08M = smd 0.6 x 2.2: 1 -1.905,-3.33; 2 -0.635,-3.33; 3 0.635,-3.33; 4 1.905,-3.33; 5 1.905,3.33; 6 0.635,3.33; 7 -0.635,3.33; 8 -1.905,3.33
ASE = smd 0.9 x 0.65: 1 -1.05,-0.825; 2 1.05,-0.825; 3 1.05,0.825; 4 -1.05,0.825
3.2X1.5-2-PAD = smd 1.1 x 1.9: 1 -1.25,0; 2 1.25,0
KUSBVX = drill 0.9 pad 1.524: 1 3.5,0; 2 1,0; 3 -1,0; 4 -3.5,0 | drill 2.3 pad 2.8: M1 -6.57,2.71; M2 6.57,2.71
CRYSTAL-SMD-5X3.2-4PAD = smd 1.9 x 1.1: 1 -1.85,-1.15; 2 1.85,-1.15; 3 1.85,1.15; 4 -1.85,1.15

### Placement (x,y rotation side)
C1  37.97,39.04 135 top
C2  41.81,49.53 90 top
C3  46.81,35.51 0 top
C4  45.8,22.28 0 top
C6  53.75,10.06 90 top
C7  48.8,34.36 90 top
C8  24.08,25.01 90 bottom
C10  43.58,49.53 90 top
C11  33.96,25.16 270 top
C12  45.26,55.35 180 top
C13  49.35,57.12 270 top
C14  49.81,61.14 90 top
C15  61.16,58.8 270 top
C16  28.05,41.44 0 top
C17  18.03,44.42 180 top
C18  18.73,37.49 180 top
C19  13.61,35.37 90 top
C20  49.61,39.4 180 top
C21  14.47,37.49 180 top
C22  5.92,24.74 180 top
C23  49.61,41.9 180 top
C24  14.3,25.11 180 top
C25  9.09,29.01 90 top
C26  77.09,20.09 270 top
C27  45.69,16.32 90 top
C29  72.59,8.23 0 top
C31  73.79,19.04 0 top
C32  11.94,36.2 90 top
C33  79.22,47.41 0 top
C34  73.63,47.41 0 top
C35  70.03,47.41 180 top
C36  73.63,54.24 270 top
C37  79.22,50.5 180 top
C38  33.46,33.36 90 top
C39  66.78,50.44 0 top
C40  64.49,41.26 90 top
C41  70.84,33.71 0 top
C42  74.15,33.71 0 top
C43  70.03,53.59 0 top
C44  78.03,53.58 180 top
C45  65.71,41.76 90 top
C46  63.04,38.61 270 top
C47  82.63,39.53 270 top
C48  77.85,34.72 0 top
C49  69.1,27.69 180 top
C50  75.95,27.69 0 top
C51  61.16,53.19 90 top
C52  57.99,43.71 270 top
C53  49.35,47.98 270 top
C54  49.35,53.09 90 top
C55  24.31,53.29 90 top
C56  68.43,32.46 270 top
C57  84.61,39.53 270 top
C58  81.92,46.58 90 top
C59  27.7,46.48 0 top
F1  46.76,59.39 270 top
IC1  48.28,16.66 0 top
IC2  55.07,60.29 270 top
IC3  41.2,29.76 180 top
IC4  19.33,29.26 180 top
IC5  55.07,51.69 270 top
JP1  74.55,62.26 270 top
JP2  58.83,6.39 0 bottom
JP3  14.9,7.62 180 bottom
JP5  43.56,65.35 270 top
L1  73.03,42.29 0 bottom
L2  66.67,44.68 180 top
L3  11.94,35.89 180 bottom
R1  8.69,33.88 270 top
R2  18.85,41.27 180 top
R3  20.11,42.85 180 top
R4  23.5,39.85 0 top
R5  24.74,41.44 0 top
R6  14.33,33.41 180 top
R7  15.77,38.84 180 top
R8  72.95,22.2 270 top
R9  34.98,36.6 90 top
R10  15.77,40.23 180 top
R11  63.91,13.49 90 bottom
R12  50.85,6.39 180 top
R13  66.57,15.98 270 top
R14  49.28,7 0 bottom
R15  11.94,29.01 90 top
R19  24.08,25.01 270 top
R20  14.48,23.14 0 top
R21  65.05,63.73 0 top
R22  70.03,50.44 0 top
R23  73.63,49.94 270 top
R24  77.55,48.92 180 top
R25  70.03,48.92 0 top
R26  80.49,42.26 90 top
R27  79.22,42.76 90 top
R28  65.84,38.01 270 top
R29  67.06,37.51 270 top
R30  82.6,37.88 180 bottom
R31  70.03,52.02 0 top
R32  78.03,52.02 180 top
R33  76.35,55.09 180 top
R34  70.02,55.12 180 top
R35  72.52,27.69 0 top
R36  53.92,38.49 90 top
R42  14.17,62.1 0 top
R43  14.17,60.53 180 top
RJ1  23.67,57.15 90 bottom
SV2  32.74,10.79 180 bottom
U1  91.44,17.2 270 bottom
U2  VS1003  [LQFP48']  73.03,40.13 270 top
U3  44.02,7.95 270 top
U$2  68.48,9.42 0 top
U$7  6.58,27.1 270 top
X2  46.3,40.65 90 top
X3  48.28,12.7 0 bottom
Y1  42.7,45.09 180 top
Y3  72.52,30.99 180 top

### Tracks (layer width: path | path; a pad name or v marks a point on that pad's centre or on a via)
3V  (via drill 0.6, 0.6 pad 1.42, 0.6 pad 1.78)
  Top 0.251: U2.6 64.71,40.38 C40.1 | C42.1 73.28,33.93 U2.19 73.28,36.83 70.78,36.83 U2.14 70.78,35.01 70.19,34.43 C41.1 | R30.2 86.41,40.62 85.62,41.4 81.84,41.4 81.32,40.88 U2.32
  Top 0.254: 64.71,40.38 61.59,40.38 61.21,40.01 v61.21,36.68
  Top 0.305: IC4.32 13.24,28.51 12.89,28.16 R15.1 | 8.77,28.16 8.76,28.16 | U$7.4 6.58,27.33 6.58,24.82 6.57,24.8 C22.1 | C8.1 22.08,24.36 IC4.48 | C41.1 68.78,33.71 68.78,33.66 C56.1 | 44.95,26.01 44.95,32.88 45.58,33.51 IC3.64 48.8,33.51 | 44.95,26.01 IC3.48 44.95,22.28 C4.1 | 36.52,26.01 IC3.32 33.96,26.01 C11.1 | 36.52,26.01 44.95,26.01 | 36.52,32.51 IC3.19 33.46,32.51 C38.1 | 36.52,32.51 36.52,26.01 | 48.8,33.51 C7.1 | 48.8,33.51 51.52,33.51 51.89,33.88 51.89,35.97 52.6,36.68 v61.21,36.68 | 36.52,32.51 36.52,33.96 36.25,34.24 35.28,34.24 34.98,34.54 R9.1
  Top 0.406: R15.1 C25.1 8.76,28.16 7.41,28.16 U$7.4 | C22.1 6.57,23.14
  Top 0.61: v24.08,22.96 C8.1 | R20.1 6.57,23.14 4.29,23.14 3,24.43 3,34.16 4.72,35.89 v8.69,35.89 R1.1 | v61.21,33.31 C56.1 | IC2.2 C14.1 | C26.+ 77.47,21.59 | 73.03,21.59 72.95,21.51 R8.2 72.94,21.34 C31.1 v72.94,17.3 72.94,15.15 71.74,13.96 C29.1 69.75,8.23 69.11,7.59 U$2.3 | U$2.8 U$2.7 | U$2.8 63.91,12.75 | U$2.8 R13.2 | R12.2 50,3.17 | R42.1 R43.2 13.32,60.49 11.88,59.05 v11.88,40.62
  Top 0.813: IC2.2 | R30.2 86.41,27.1 80.9,21.59 77.47,21.59 73.03,21.59 v63.91,21.59 | v13.63,21.38 R20.1
  Top 1.016: IC2.2 IC2.TAB 58.18,60.3 C15.+ 61.21,60.35 v61.21,62.46 | v63.91,15.93 63.91,12.75 JP2.1 63.91,4.22 62.87,3.17 50,3.17 15.88,3.17 13.63,5.42 JP3.1 v13.63,21.38
  Bottom 0.406: v24.08,22.96 22.49,21.38 v13.63,21.38
  Bottom 0.61: U1.4 v72.94,17.3 | v63.91,15.93 R11.2 | C8.1 v24.08,22.96 | v11.88,40.62 9.5,40.62 8.69,39.8 v8.69,35.89 L3.1
  Bottom 1.016: v63.91,15.93 v63.91,21.59 63.91,30.62 v61.21,33.31 v61.21,36.68 v61.21,62.46
5V  (via drill 0.6 pad 1.42)  (1 unrouted)
  Top 0.406: 49.52,57.98 49.53,57.98
  Top 0.599: U3.5 v48.28,8.9
  Top 0.61: F1.2 49.53,57.98 | C12.+ 46.76,55.24
  Top 0.813: 49.53,57.98 51.96,57.98 IC2.3 | IC5.3 | C53.1 49.3,49.38 | C53.1 | IC5.3
  Top 1.016: IC5.3 C53.1 | C53.1 | F1.2 46.76,55.24 46.76,50.39 47.77,49.38 C53.1 | IC5.3 54.13,49.38 56.31,47.19 v57.99,47.19 C52.+
  Bottom 0.813: v57.99,47.19 57.99,11.35 55.53,8.9 v48.28,8.9
_2V6  (via drill 0.6 pad 1.42)
  Top 0.61: L2.2 v64.11,44.68
  Top 0.813: IC5.2
  Top 1.016: IC5.2 IC5.TAB 61.67,51.69 C51.+ 63.25,51.69 64.11,50.83 v64.11,44.68 | C54.1 IC5.2
  Bottom 0.61: L1.2 70.87,42.29 68.48,44.68 v64.11,44.68
A3V  (via drill 0.6 pad 1.42)  (1 unrouted)
  Top 0.305: IC4.22 17.58,34.74 16.43,35.89 v15.12,35.89
  Top 0.406: R4.2 24.34,40.2 25.29,40.2 25.29,41.44 | C16.1 26.85,41.78 C59.1 | C59.1 | C59.1 26.85,48.79 26.11,49.53 24.31,49.53 | C55.1 18.53,52.44 17.86,51.77 17.86,47.62 19.26,46.23 19.26,44.25 | C17.1 19.08,44.42 19.26,44.25 | 19.26,44.25 R3.2 19.27,42.5 18.29,42.5 18.29,41.27 R2.2 15.12,41.27 R10.2 R7.2 C21.1 | v15.12,35.89 C21.1 | C21.1
  Top 0.61: R5.2 C16.1 | RJ1.P4 24.31,49.53 RJ1.P5 C55.1
  Bottom 0.61: L3.2 v15.12,35.89
D2_N
  Top 0.406: IC1.1 47.33,12.75 X3.2
D2_P
  Top 0.406: IC1.3 49.23,12.77 X3.3
DP_RST  (via drill 0.6 pad 1.42)
  Top 0.305: IC4.29 13.65,30.01 12.72,30.94 10.97,30.94 R1.2 | IC3.22 28.15,31.01 v26.77,32.38
  Top 0.406: v5.99,33.22 8.68,33.22 R1.2
  Bottom 0.305: v5.99,33.22 9.55,33.22 11.23,31.55 25.93,31.55 v26.77,32.38
ECRSDV  (via drill 0.6 pad 1.42)
  Top 0.305: IC4.40 18.08,23.07 21.29,19.86 26.29,19.86 v27.64,18.52 | IC3.23 30.77,30.51 27.64,27.38 v27.64,24.64
  Bottom 0.305: v27.64,18.52 v27.64,24.64
EINT
  Top 0.305: IC4.7 22.69,29.51 22.68,29.52 22.4,29.52 22.12,29.23 22.12,26.47 22.73,25.86 24.08,25.86 R19.1
EMDC  (via drill 0.6 pad 1.42)
  Top 0.305: IC4.31 6.73,29.01 5.99,29.74 v5.99,31.42 | IC3.9 40.95,38.22 37.59,41.58 32.23,41.58 29.21,38.56 v29.21,36.09
  Bottom 0.305: v5.99,31.42 7.16,32.59 9.32,32.59 10.97,30.94 27.3,30.94 27.94,31.57 27.94,34.82 v29.21,36.09
EMDIO  (via drill 0.6 pad 1.42)
  Top 0.305: IC4.30 13.24,29.51 12.89,29.86 R15.2 11.19,29.86 9.63,31.42 v8.53,31.42 | IC3.16 37.45,37.38 36.07,38.76 32.41,38.76 31.65,38 31.65,34.44 30.96,33.76 v29.21,33.76
  Bottom 0.305: v8.53,31.42 9.63,31.42 10.72,30.33 27.56,30.33 29.21,31.98 v29.21,33.76
EREFCLK  (via drill 0.6 pad 1.42)
  Top 0.305: U$7.3 7.4,26.17 8.18,26.95 v10.52,26.95 13.44,26.95 14,27.51 IC4.34 | IC3.15 37.95,37.74 36.32,39.37 32.16,39.37 30.48,37.69 v30.48,34.92
  Bottom 0.305: v10.52,26.95 26.31,26.95 30.48,31.11 v30.48,34.92
ERXD0  (via drill 0.6 pad 1.42)
  Top 0.305: IC4.43 19.58,22.43 21.54,20.47 28.12,20.47 v28.8,19.79 | IC3.24 31.13,30.01 28.8,27.69 v28.8,25.92
  Bottom 0.305: v28.8,25.92 v28.8,19.79
ERXD1  (via drill 0.6 pad 1.42)
  Top 0.305: IC4.44 20.08,22.8 21.79,21.08 v29.97,21.08 | IC3.25 31.49,29.51 29.97,27.99 v29.97,24.66
  Bottom 0.305: v29.97,24.66 v29.97,21.08
ETXD0
  Top 0.305: IC4.3 25.17,27.51 25.86,26.82 25.86,23.67 26.67,22.86 37.16,22.86 37.45,23.15 IC3.33
ETXD1
  Top 0.305: IC3.34 37.95,24.94 37.77,25.12 37.13,25.12 36.83,24.82 36.83,23.75 36.55,23.47 26.92,23.47 26.47,23.93 26.47,27.08 25.53,28.01 IC4.4
ETXEN  (via drill 0.6 pad 1.42)
  Top 0.305: IC3.30 v32.03,27.01 | IC4.2 24.8,27.01 25.25,26.57 25.25,23.44 26.44,22.25 30.86,22.25 v32.03,21.08
  Bottom 0.305: v32.03,21.08 v32.03,27.01
FLASH_CS
  Top 0.305: IC3.50 54.41,26.51 63.73,17.2 66.67,17.2 | 66.67,17.2 68.07,17.2 68.48,16.79 68.48,10.29 66.57,8.38 U$2.1 | R13.1 66.57,17.09 66.67,17.2
  Top 0.61: 66.57,8.64 U$2.1
GND  (via drill 0.5 pad 1.27, 0.5 pad 1.42, 0.6 pad 1.42, 0.61 pad 1.42)
  Top 0.251: U2.4 67.25,41.38 66.2,42.41 C45.2 | U2.20 73.78,36.83 74.24,36.83 | 74.24,36.83 74.78,36.83 U2.22 74.78,33.73 C42.2 | U2.21 74.28,36.8 74.24,36.83 | U2.16 71.78,34.95 71.49,34.66 C41.2
  Top 0.254: IC1.2 48.45,14.36 48.45,15.19 48.73,15.47 50.8,15.47
  Top 0.305: v21.82,37.31 21.82,36.12 21.08,35.38 IC4.15 21.08,30.6 | IC4.19 19.08,35.84 18.08,36.84 C18.2 | IC4.35 14.36,27.01 13.54,26.19 | IC4.47 v21.58,22.96 | v53.19,34.92 53.19,33.01 IC3.63 46.04,33.01 45.82,32.79 45.82,31.73 46.03,31.51 IC3.60 | IC3.47 44.45,21.18 44.7,20.93 46.45,20.93 C4.2 | IC3.12 39.45,38.86 38.18,40.13 38.1,40.13 37.51,39.55 C1.2 | IC4.6 v26.2,29.01 | IC3.31 33.22,26.51 32.89,26.19 32.89,24.51 | IC3.18 34.37,33.01 34.37,34.01 C38.2
  Top 0.406: JP5.GND1 v42.26,60.42
  other vias: 52.02,64.52 63.42,36.6 62.86,42.02 68.4,36.12 76.43,29.84 68.43,29.84 82.02,43.64 58.6,56.16 83.92,35.53 18.64,39.22 11.88,38.51 12.09,33.45 12.06,25.11 25.55,44.02 7.24,30.2 4.42,26.38 15.36,44.02 28.72,44.02 74.19,8.41 6.09,14.63 47.12,23.93 4.82,47.65 50.42,34.92 47.12,44.48 35.05,40.49 35.27,24.66 33.02,35.81 26.03,35.81 20.69,11.46
  pour Top (isolate 0.305, rank 2, no thermals): 0,0 0,66.04 91.44,66.04 91.44,0
  pour Bottom (isolate 0.305, no thermals): 0,66.04 0,0 91.44,0 91.44,66.04
LED_ACT
  Top 0.305: RJ1.G- 18.36,63.35 12.22,63.35 10.52,61.65 10.52,33.3 11.67,32.15 13.22,32.15 13.85,31.51 IC4.26
LED_LINK
  Top 0.305: IC4.28 14,30.51 12.96,31.55 11.4,31.55 9.91,33.05 9.91,61.9 11.96,63.96 20.14,63.96 22,62.1 RJ1.Y-
MISO  (via drill 0.6 pad 1.42)
  Top 0.305: IC3.52 55.14,27.51 63.42,19.23 v70.26,19.23 70.26,17.3 69.75,16.79 69.75,10.69 67.84,8.79 U$2.2
  Bottom 0.305: U1.7 71.62,20.6 v70.26,19.23
MOSI  (via drill 0.6 pad 1.42)
  Top 0.305: IC3.53 55.5,28.01 63.09,20.42 70.74,20.42 71.42,19.74 v71.42,16.13 70.38,15.09 U$2.5
  Bottom 0.305: U1.3 77.07,16.13 v71.42,16.13
N$1
  Top 0.305: IC4.21 18.08,35.11 16.42,36.76 R7.1
N$2
  Top 0.305: C3.1 IC3.1
N$3
  Top 0.305: IC4.24 R6.1
N$6
  Top 0.305: IC4.20 18.58,35.47 17.14,36.91 17.14,39.51 R10.1
N$7
  cutout Top: 16.51,25.45 16.51,27.18 15.93,27.18 15.93,25.45
N$8  (via drill 0.6 pad 1.27)
  other vias: 86.49,5.01
N$9  (via drill 0.6 pad 1.27)
  other vias: 86.44,61.04
N$11  (via drill 0.6 pad 1.27)
  other vias: 5,61.04
N$12
  Top 0.61: R42.2 RJ1.G+
N$17
  Top 0.406: F1.1 44.86,60.78 JP5.VBUS1
N$18
  Top 0.406: C36.2 R23.1
N$19
  Top 0.406: R43.1 28.7,60.53 RJ1.Y+
N$28
  Top 0.305: R9.2 36.41,37.55 36.7,37.26 36.7,34.72 36.98,34.44 38.95,34.44 IC3.13 38.95,38.06 C1.1
N$36  (via drill 0.6 pad 1.27)
  other vias: 5,5
NRST  (via drill 0.6 pad 1.42)
  Top 0.305: v53.01,19.07 57.12,19.07 58.52,17.68 58.52,12.7 55.03,9.21 C6.1 | IC3.7 41.95,39.79 v41.15,40.59
  Top 0.61: R12.1 JP2.5 C6.1
  Bottom 0.305: v53.01,19.07 53.01,30.18 52.07,31.11 42.89,31.11 41.95,32.05 41.95,39.79 v41.15,40.59
OSC32_IN
  Top 0.305: IC3.3 43.95,38.87 44.48,39.4 X2.1
  Top 0.61: C20.2 X2.1
OSC32_OUT
  Top 0.305: IC3.4 43.45,40.91 44.45,41.91 44.46,41.9 X2.2
  Top 0.61: C23.2 X2.2
OSC_IN
  Top 0.305: IC3.5 42.95,46.23 | 42.95,46.23 42.95,47.09 43.58,47.72 C10.1 | Y1.1 42.95,46.23
OSC_OUT
  Top 0.305: IC3.6 42.45,43.94 | 42.45,43.94 42.45,47.09 41.81,47.72 C2.1 | Y1.3 42.45,43.94
PA8
  Top 0.305: IC3.41 41.45,20.77 36.55,15.88 36.55,10.79 SV2.8
PA9
  Top 0.305: IC3.42 41.95,20.41 37.82,16.28 SV2.9
PA10
  Top 0.305: IC3.43 42.45,20.05 39.17,16.76 39.17,10.87 SV2.10
PB14
  Top 0.305: IC3.35 38.45,22.95 28.93,13.44 28.93,10.79 SV2.2
PB15
  Top 0.305: IC3.36 38.95,22.59 30.2,13.84 SV2.3
PC6
  Top 0.305: IC3.37 39.45,22.23 31.47,14.25 31.47,10.79 SV2.4
PC7
  Top 0.305: IC3.38 39.95,21.86 32.74,14.66 SV2.5
PC8
  Top 0.305: IC3.39 40.45,21.5 34.01,15.06 34.01,10.79 SV2.6
PC9
  Top 0.305: IC3.40 40.95,21.14 35.28,15.47 SV2.7
RD_N
  Top 0.254: 23.5,41.35 23.5,36.3 22.08,34.89 IC4.13 | 23.5,41.35 23.5,42.57 arc-90 23.88,42.95 23.99,42.95 arc90 24.37,43.33 24.37,43.34 arc90 23.99,43.73 23.88,43.73 arc-90 23.5,44.11 23.5,44.12 arc-90 23.88,44.5 23.99,44.5 arc90 24.37,44.88 24.37,44.89 arc90 23.99,45.27 23.88,45.27 arc-90 23.5,45.65 23.5,46.18 RJ1.RD- | R5.1 23.58,41.44 23.5,41.35
RD_P
  Top 0.254: 23.04,39.9 23.04,46.43 21.77,47.7 RJ1.RD+ | IC4.14 21.58,35.03 23.04,36.49 23.04,39.9 | R4.1 22.99,39.85 23.04,39.9
REG_OUT
  Top 0.305: 17.08,32.11 IC4.23 17.08,34.38 16.74,34.72 C19.1 | 17.08,32.11 19.58,32.11 IC4.18 19.58,37.37 19.46,37.49 C18.1 | 17.08,32.11 16.58,31.61 IC4.37 C24.1
  Top 0.406: C19.1 12.57,34.71 C32.1
RX_DV
  Top 0.305: IC4.39 17.58,23.49 17.23,23.14 R20.2
SCK  (via drill 0.6 pad 1.42)
  Top 0.305: IC3.51 54.78,27.01 63.98,17.8 v69.11,17.8 U$2.6
  Bottom 0.305: U1.5 77.07,18.47 72.44,18.47 71.78,17.8 v69.11,17.8
SD_CS  (via drill 0.6 pad 1.42)
  Top 0.305: v61.98,12.64 61.98,18.09 55.99,24.07 v54.36,24.07 | IC3.62 53.6,32.51 v54.36,33.26
  Bottom 0.305: U1.2 72.88,15.1 70.42,12.64 R11.1
  Bottom 0.406: v54.36,24.07 v54.36,33.26
  Bottom 0.61: R11.1 v61.98,12.64
SD_PRESENT  (via drill 0.6 pad 1.42)
  Top 0.305: IC3.54 55.87,28.51 61.33,23.05 73.03,23.05 | v74.88,23.05 73.03,23.05 | R8.1 73.02,23.05 73.03,23.05
  Bottom 0.61: U1.CD1 v74.88,23.05
SWD_CLK
  Top 0.305: IC3.49 52.63,26.01 53.26,25.38 53.26,23.5 53.87,22.89 56.31,22.89 60.81,18.39 60.81,12.14 61.37,11.58 JP2.2
SWD_IO
  Top 0.305: IC3.46 43.95,20.82 44.45,20.32 58.01,20.32 60.12,18.21 60.12,12.14 56.29,8.31 JP2.4
TD_N
  Top 0.254: IC4.16 20.58,42.98 | 20.58,42.98 20.58,43.76 arc-90 21.01,44.2 21.24,44.2 arc90 21.68,44.63 21.68,44.64 arc90 21.24,45.07 21.01,45.07 arc-90 20.58,45.51 20.58,45.51 arc-90 21.01,45.95 21.24,45.95 arc90 21.68,46.38 21.68,46.39 arc90 21.24,46.82 21.01,46.82 arc-90 20.58,47.26 20.58,48.18 RJ1.TD- | R3.1 20.71,42.85 20.58,42.98
TD_P
  Top 0.254: IC4.17 20.08,41.07 | 20.08,41.07 20.08,46.83 19.23,47.68 RJ1.TD+ | R2.1 19.88,41.27 20.08,41.07
UART_TX  (via drill 0.6 pad 1.42)
  Top 0.305: IC3.29 33.98,27.51 v33.3,28.19 | SV2.1 27.66,13.84 27.69,13.84 v32.03,18.19
  Bottom 0.305: v33.3,28.19 33.3,19.46 v32.03,18.19
USB_EN  (via drill 0.6 pad 1.42)
  Top 0.305: IC3.8 41.45,38.59 v37.26,42.77
  Top 0.599: v46.84,7 U3.4
  Bottom 0.305: v46.84,7 41.18,7 39.37,8.81 39.37,40.66 v37.26,42.77
  Bottom 0.61: v46.84,7 R14.2
USB_N
  Top 0.254: IC1.6 47.33,17.46 48.03,18.16 48.03,18.91 47.71,19.23 44.02,19.23 42.95,20.3 IC3.44
USB_OVERCURRENT  (via drill 0.6 pad 1.42)
  Top 0.305: IC3.21 32.62,31.51 v31.75,32.38 | v24.66,15.39 24.66,8.46 26.12,7 U3.3
  Bottom 0.305: v31.75,32.38 31.75,30.53 26.47,25.25 26.47,17.2 v24.66,15.39
USB_P
  Top 0.254: IC1.4 49.23,17.46 48.53,18.16 48.53,19.05 47.9,19.68 44.21,19.68 43.45,20.45 IC3.45
VBUS  (1 unrouted)
  Top 0.254: IC1.5 48.11,16.66 48.11,15.75 47.82,15.47 C27.1
  Top 0.599: U3.1 42.87,10.79 X3.1
  Top 0.61: X3.1 45.7,13.62 C27.1
VS_AGND
  Top 0.251: U2.47 70.78,45.02 69.18,46.62 C35.2 | U2.41 73.78,45.33 74.16,45.33 74.28,45.21 | U2.40 74.28,45.21 | 74.28,45.21 74.28,47.2 C34.2 | U2.37 75.78,45.04 76.96,46.23 79.76,46.23 80.07,46.55 C33.2
  Top 0.406: C35.2 R25.1 65.93,48.92 C39.1 | C37.1 C33.2 | 74.55,59.89 74.47,59.82 | 66.03,53.37 65.93,53.47 | C34.2 75.5,48.42 R33.2
  Top 0.61: 73.03,59.82 74.47,59.82 80.14,59.82 81.41,58.55 81.41,56.13 80.07,54.8 C37.1 | 73.03,59.82 67.31,59.82 65.93,58.43 65.93,55.12 | JP1.SLEEVE 74.55,59.89 | C39.1 65.93,53.47 65.93,55.12 | 73.03,59.82 73.03,56.64 73.64,56.03 C36.1 R33.2 | R34.2 65.93,55.12
  pour Top (isolate 0.305, no thermals): 65.41,66.17 65.41,46.99 83.31,46.99 83.31,58.04 81.92,59.44 81.92,66.17
VS_AVDD  (via drill 0.6 pad 1.42)
  Top 0.251: C35.1 70.88,46.62 71.78,45.73 U2.45 71.78,43.43 72.78,43.43 | C34.1 72.78,46.76 U2.43 72.78,43.43 | C33.1 77.02,47.41 75.28,45.66 U2.38 75.28,43.43 | 75.28,43.43 72.78,43.43 | 75.28,43.43 76.35,43.43 v77.22,44.3
  Top 0.406: v77.22,44.3 78.51,45.59 81.77,45.59 C58.1
  Bottom 0.61: L1.1 75.21,42.29 v77.22,44.3
VS_CVDD
  Top 0.251: C45.1 65.93,40.88 U2.5 69.8,40.88 | 69.8,40.88 69.8,43.36 | 75.77,39.88 75.78,39.88 U2.24 75.78,34.72 C48.1 | 75.77,39.88 76.27,40.38 U2.31 C47.1 | 69.8,40.88 69.8,39.88 | 69.8,39.88 75.77,39.88 | 69.8,39.88 U2.7 63.47,39.88 C46.1
  Top 0.254: 69.8,43.36 68.48,44.68 L2.1
  Top 0.61: C47.1 C57.1
VS_DREQ
  Top 0.254: U2.8 65.09,39.38 64.9,39.19 64.9,35.81 64.62,35.53 60.22,35.53 56.7,32.01 IC3.61
VS_MISO
  Top 0.251: 79.32,39.88 79.85,39.88 81.69,38.05
  Top 0.254: 78.66,39.88 U2.30 79.32,39.88 | 81.69,38.05 82.27,37.47 82.27,29.11 77.93,24.77 61.24,24.77 56.49,29.51 IC3.56
VS_MOSI
  Top 0.251: 79.03,39.38 79.57,39.38 81.13,37.82
  Top 0.254: U2.29 79.03,39.38 | 81.13,37.82 81.71,37.24 81.71,29.34 77.7,25.32 61.47,25.32 56.78,30.01 IC3.57
VS_N$9
  Top 0.251: U2.18 72.78,32.07 | 72.78,32.07 72.78,29.23 73.38,28.63 R35.2 | Y3.1 72.84,32.14 72.78,32.07
  Top 0.61: R35.2 C50.1
VS_N$13
  Top 0.251: U2.17 72.28,29.84 | 72.28,29.84 72.28,29.2 71.67,28.6 R35.1 | Y3.3 72.27,29.84 72.28,29.84
  Top 0.254: R35.1 71.67,27.59
  Top 0.61: R35.1 C49.1
VS_N$14
  Top 0.251: U2.46 71.28,45.36 70.03,46.61 70.03,49.55 70.88,50.41 R22.2
  Top 0.406: R22.2 R31.2
VS_N$15
  Top 0.251: U2.42 73.28,46.2 73.64,46.56 R23.2
VS_N$16
  Top 0.251: U2.39 74.78,45.97 76.7,47.89 R24.2
  Top 0.406: R24.2 76.7,50.08 77.19,50.57 77.19,52.02 R32.2
VS_N$17
  Top 0.251: U2.44 72.28,45.94 71.83,46.38 71.83,48.55 70.88,48.55 R25.2
VS_N$24
  Top 0.305: 78.37,49.48 R24.1
  Top 0.406: C37.2 78.37,49.48
VS_N$25
  Top 0.406: C39.2 R22.1
VS_N$26
  Top 0.251: U2.10 67.87,38.38 67.28,38.38 R29.1
VS_N$27
  Top 0.251: U2.9 66.06,38.88 R28.1
VS_N$28
  Top 0.251: U2.34 79,41.88 R27.1
VS_N$30
  Top 0.251: U2.33 80.26,41.38 R26.1
VS_N$34
  Top 0.251: U2.26 R30.1
VS_N$35
  Top 0.406: R31.1 C43.1
VS_N$36
  Top 0.406: R32.1 C44.1
VS_N$37
  Top 0.61: JP1.RING 78.08,57.26 77.2,56.37 R33.1 77.18,55.07 C44.2
VS_N$38
  Top 0.406: C43.2 70.88,55.1 R34.1
  Top 0.61: 70.88,55.1 70.88,56.25 69.87,57.26 JP1.TIP
VS_SCK  (via drill 0.6 pad 1.42)
  Top 0.254: U2.28 79.33,38.88 80.57,37.64 v80.57,32.26 | v83.41,32.26 83.41,29.46 78.16,24.21 61.01,24.21 56.21,29.01 IC3.55
  Bottom 0.406: v80.57,32.26 v83.41,32.26
VS_XCS
  Top 0.254: U2.23 75.28,37.22 75.01,37.49 70.36,37.49 69.7,36.83 69.7,35.56 69.11,34.98 60.45,34.98 56.49,31.01 IC3.59
VS_XDCS
  Top 0.254: U2.13 70.28,35.3 69.39,34.42 60.69,34.42 56.78,30.51 IC3.58
VS_XRST
  Top 0.254: U2.3 67.9,41.88 66.5,43.28 61.47,43.28 60.66,42.47 60.66,37.74 60.17,37.26 53.98,37.26 | IC3.2 44.45,36.5 45.21,37.26 53.98,37.26 | R36.1 53.92,37.31 53.98,37.26